# Altium project Prototype_1.PrjPcb (part 1 of 2)
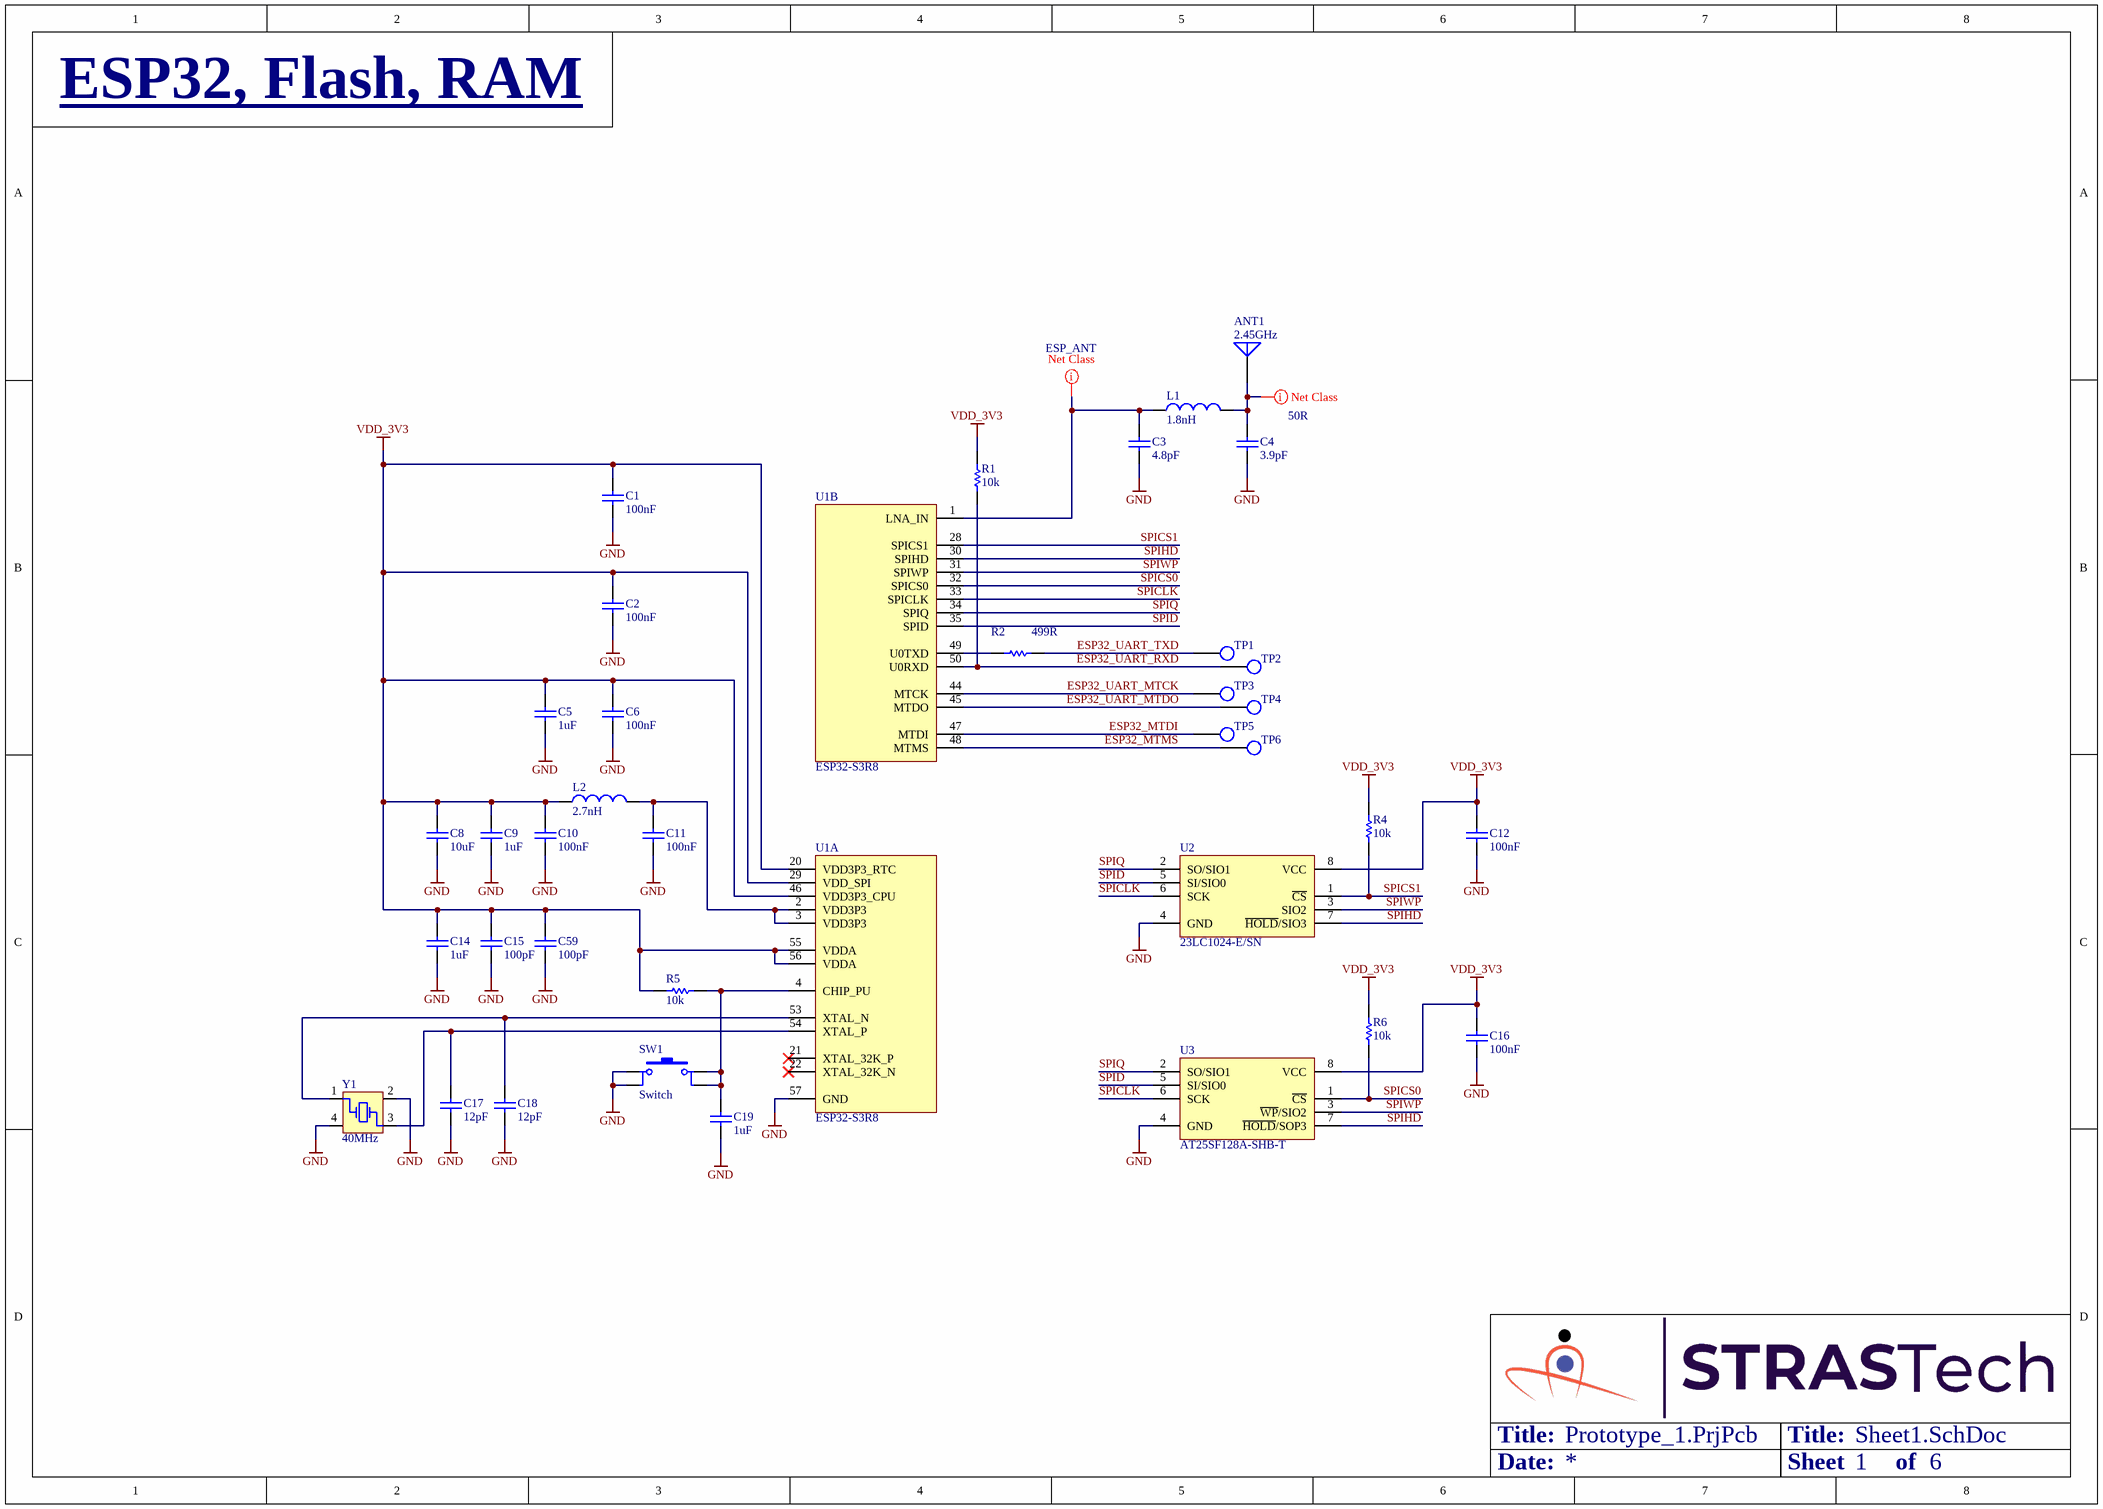
[diagram p0: Sheet1.SchDoc]
6 sheets, 240 parts. Net scope: global (net labels, ports and power ports of the same name join across sheets).
Board file: PCB1.PcbDoc
Sheets:
  Sheet1.SchDoc
  Sheet2.SchDoc
  Sheet3.SchDoc
  Sheet4.SchDoc
  Sheet5.SchDoc
  Sheet6.SchDoc

## Sheet Sheet1.SchDoc
size A3; Organization: Altium Limited; Address1: L3, 12a Rodborough Rd; Address2: Frenchs Forest; Address3: NSW; Address4: Australia 2086; SheetNumber: 1; SheetTotal: 6

### Parts
ANT1  2.45GHz  [ANT,PCB,IFA,2.45GHZ]
C1  100nF  [Cap,SMD,0402]
C2  100nF  [Cap,SMD,0402]
C3  4.8pF  [Cap,SMD,0402]
C4  3.9pF  [Cap,SMD,0402]
C5  1uF  [Cap,SMD,0402]
C6  100nF  [Cap,SMD,0402]
C8  10uF  [Cap,SMD,0402]
C9  1uF  [Cap,SMD,0402]
C10  100nF  [Cap,SMD,0402]
C11  100nF  [Cap,SMD,0402]
C12  100nF  [Cap,SMD,0402]
C14  1uF  [Cap,SMD,0402]
C15  100pF  [Cap,SMD,0402]
C16  100nF  [Cap,SMD,0402]
C17  12pF  [Cap,SMD,0402]
C18  12pF  [Cap,SMD,0402]
C19  1uF  [Cap,SMD,0402]
C59  100pF  [Cap,SMD,0402]
L1  1.8nH  [ind,0402]
L2  2.7nH  [ind,0402]
R1  10k  [RES,0402]
R2  499R  [RES,0402]
R4  10k  [RES,0402]
R5  10k  [RES,0402]
R6  10k  [RES,0402]
SW1  Switch  [Switch,Tactile,Micro,SPST-NO,SMD]
TP1  TESTPOINT  [testpoint,smd,round,1mm]  (value not drawn)
TP2  TESTPOINT  [testpoint,smd,round,1mm]  (value not drawn)
TP3  TESTPOINT  [testpoint,smd,round,1mm]  (value not drawn)
TP4  TESTPOINT  [testpoint,smd,round,1mm]  (value not drawn)
TP5  TESTPOINT  [testpoint,smd,round,1mm]  (value not drawn)
TP6  TESTPOINT  [testpoint,smd,round,1mm]  (value not drawn)
U1  ESP32-S3R8  [IC,QFN-56,7X7,P0.4MM]  (parts A,B of 3)
U2  23LC1024-E/SN  [IC,SOIC-8,1.27mm,W3.9]
U3  AT25SF128A-SHB-T  [IC,SOIC-8,1.27mm,W3.9]
Y1  40MHz  [XTAL,SMD,4 Pin,2x2.5mm]

### Nets
GND: C1.1 C2.1 C3.1 C4.1 C5.1 C6.1 C8.1 C9.1 C10.1 C11.1 C12.1 C14.1 C15.1 C16.1 C17.2 C18.2 C19.1 C59.1 SW1.1 SW1.2 U1.57(GND) U2.4(GND) U3.4(GND) Y1.2(GND) Y1.4(GND)
VDD_3V3: C1.2 C2.2 C5.2 C6.2 C8.2 C9.2 C10.2 C12.2 C14.2 C15.2 C16.2 C59.2 L2.1 R1.2 R4.2 R5.2 R6.2 U1.20(VDD3P3_RTC) U1.29(VDD_SPI) U1.46(VDD3P3_CPU) U1.55(VDDA) U1.56(VDDA) U2.8(VCC) U3.8(VCC)
ESP32_MTDI: TP5.1(TP) U1.47(MTDI)
ESP32_MTMS: TP6.1(TP) U1.48(MTMS)
ESP32_UART_MTCK: TP3.1(TP) U1.44(MTCK)
ESP32_UART_MTDO: TP4.1(TP) U1.45(MTDO)
ESP32_UART_RXD: R1.1 TP2.1(TP) U1.50(U0RXD)
ESP32_UART_TXD: R2.2 TP1.1(TP)
SPICLK: U1.33(SPICLK) U2.6(SCK) U3.6(SCK)
SPICS0: R6.1 U1.32(SPICS0) U3.1(~{CS})
SPICS1: R4.1 U1.28(SPICS1) U2.1(~{CS})
SPID: U1.35(SPID) U2.5(SI/SIO0) U3.5(SI/SIO0)
SPIHD: U1.30(SPIHD) U2.7(~{HOLD}/SIO3) U3.7(~{HOLD}/SOP3)
SPIQ: U1.34(SPIQ) U2.2(SO/SIO1) U3.2(SO/SIO1)
SPIWP: U1.31(SPIWP) U2.3(SIO2) U3.3(~{WP}/SIO2)
NetANT1_1: ANT1.1 C4.2 L1.2
NetC3_2: C3.2 L1.1 U1.1(LNA_IN)
NetC11_2: C11.2 L2.2 U1.2(VDD3P3) U1.3(VDD3P3)
NetC17_1: C17.1 U1.54(XTAL_P) Y1.3(OSC2)
NetC18_1: C18.1 U1.53(XTAL_N) Y1.1(OSC1)
NetC19_2: C19.2 R5.1 SW1.3 SW1.4 U1.4(CHIP_PU)
NetR2_1: R2.1 U1.49(U0TXD)

Not connected (* = marked no-connect by the designer): U1 21(XTAL_32K_P)* 22(XTAL_32K_N)*

### Layout directives
net class ESP_ANT: NetC3_2
net class 50R: NetANT1_1

### Notes on the sheet
- ESP32, Flash, RAM
- Title:
- Date:
- Sheet
- of
- Title
- Size:
- A3
- Revision:
- Design By:

### Library data of the parts
ANT1 = ANT,2.45GHz,IFA,PCB: 2.4-GHz Inverted F Antenna; HelpURL: https://www.ti.com/lit/an/swru120d/swru120d.pdf?ts=1646240772720&ref_url=https%253A%252F%252Fwww.google.com%252F; CreatedBy: Judd Foster; Manufacturer: N/A; Manufacturer Part Number: N/A; Vendor: N/A; Vendor Part Number: N/A
C1 C2 C6 C10-C12 C16 = CAP,Cer,100nF,25VDC,X7R,0402: 0.1µF ±10% 25V Ceramic Capacitor X7R 0402 (1005 Metric); Vendor Part Number: 490-14603-1-ND; Manufacturer: Murata Electronics; Manufacturer Part Number: GRM155R71E104KE14J; Vendor: Digikey; HelpURL: https://search.murata.co.jp/Ceramy/image/img/A01X/G101/ENG/GRM155R71E104KE14-01.pdf; CreatedBy: Judd Foster
C3 = CAP,Cer,4.8pF,50VDC,C0G/NP0,0402: 4.8 pF ±0.25pF 50V Ceramic Capacitor C0G, NP0 0402 (1005 Metric); Vendor Part Number: 490-17481-1-ND; Manufacturer: Murata Electronics; Manufacturer Part Number: GCQ1555C1H4R8CB01D; Vendor: Digikey; HelpURL: https://search.murata.co.jp/Ceramy/image/img/A01X/G101/ENG/GCQ1555C1H4R8CB01-01.pdf; CreatedBy: Judd Foster
C4 = CAP,Cer,3.9pF,50VDC,C0G/NP0,0402: 3.9 pF ±0.1pF 50V Ceramic Capacitor C0G, NP0 0402 (1005 Metric); Vendor Part Number: 399-CBR04C399B5GACCT-ND; Manufacturer: KEMET; Manufacturer Part Number: CBR04C399B5GAC; Vendor: Digikey; HelpURL: https://api.kemet.com/component-edge/download/datasheet/CBR04C399B5GAC.pdf; CreatedBy: Judd Foster
C5 C9 C14 = CAP,Cer,1uF,35VDC,X5R,0402: 1 µF ±10% 35V Ceramic Capacitor X5R 0402 (1005 Metric); Vendor Part Number: 445-9073-1-ND; Manufacturer: TDK Corporation; Manufacturer Part Number: C1005X5R1V105K050BC; Vendor: Digikey; HelpURL: https://product.tdk.com/info/en/catalog/datasheets/mlcc_commercial_general_en.pdf?ref_disty=digikey; CreatedBy: Judd Foster
C8 = CAP,Cer,10uF,10VDC,X5R,0402: 10 µF ±20% 10V Ceramic Capacitor X5R 0402 (1005 Metric); Vendor Part Number: 1276-1450-1-ND; Manufacturer: Samsung Electro-Mechanics; Manufacturer Part Number: CL05A106MP5NUNC; Vendor: Digikey; HelpURL: https://media.digikey.com/pdf/Data%20Sheets/Samsung%20PDFs/CL05A106MP5NUNC_Spec.pdf; CreatedBy: Judd Foster
C15 C59 = CAP,Cer,100pF,50VDC,C0G/NP0,0402: 100pF ±5% 50V Ceramic Capacitor C0G, NP0 0402 (1005 Metric); Vendor Part Number: 490-10669-1-ND; Manufacturer: Murata Electronics; Manufacturer Part Number: GCM1555C1H101JA16D; Vendor: Digikey; HelpURL: https://www.murata.com/~/media/webrenewal/support/library/catalog/products/capacitor/mlcc/c03e.ashx?la=en-us; CreatedBy: Judd Foster
C17 C18 = CAP,Cer,12pF,50VDC,C0G/NP0,0402: 12pF ±5% 50V Ceramic Capacitor C0G, NP0 0402 (1005 Metric); Vendor Part Number: 311-1016-1-ND; Manufacturer: Yageo; Manufacturer Part Number: CC0402JRNPO9BN120; Vendor: Digikey; HelpURL: https://www.yageo.com/upload/media/product/productsearch/datasheet/mlcc/UPY-GP_NP0_16V-to-50V_18.pdf; CreatedBy: Judd Foster
C19 = CAP,Cer,1uF,6.3VDC,X5R,0402: 1µF ±20% 6.3V Ceramic Capacitor X5R 0402 (1005 Metric); Vendor Part Number: 1276-1235-1-ND; Manufacturer: Samsung Electro-Mechanics; Manufacturer Part Number: CL05A105MQ5NNNC; Vendor: Digikey; HelpURL: https://media.digikey.com/pdf/Data%20Sheets/Samsung%20PDFs/CL_Series_MLCC_ds.pdf; CreatedBy: Judd Foster
L1 = IND,1.8nH,900mA,Multilayer,0402: 1.8 nH Unshielded Multilayer Inductor 900 mA 100mOhm Max 0402 (1005 Metric); Vendor Part Number: 490-1076-1-ND; Manufacturer: Murata Electronics; Manufacturer Part Number: LQG15HN1N8S02D; Vendor: Digikey; HelpURL: https://search.murata.co.jp/Ceramy/image/img/P02/JELF243B-0009.pdf; CreatedBy: Judd Foster
L2 = IND,2.7nH,800mA,Multilayer,0402: 2.7nH Unshielded Multilayer Inductor 800mA 150mOhm Max 0402 (1005 Metric); Vendor Part Number: 490-2615-1-ND; Manufacturer: Murata Electronics; Manufacturer Part Number: LQG15HS2N7S02D; Vendor: Digikey; HelpURL: https://psearch.en.murata.com/inductor/product/LQG15HS2N7S02_.pdf; CreatedBy: Judd Foster
R1 R4-R6 = RES,10k,5%,0.063W,0402: 10 kOhms ±5% 0.063W, 1/16W Chip Resistor 0402 (1005 Metric) Automotive AEC-Q200 Thick Film; Vendor Part Number: RMCF0402JT10K0CT-ND; Manufacturer: Stackpole Electronics Inc; Manufacturer Part Number: RMCF0402JT10K0; Vendor: DIgikey; HelpURL: https://www.seielect.com/catalog/sei-rmcf_rmcp.pdf; CreatedBy: Judd Foster
R2 = RES,499R,1%,0.063W,0402: 499 Ohms ±1% 0.063W, 1/16W Chip Resistor 0402 (1005 Metric) Automotive AEC-Q200 Thick Film; Manufacturer: Stackpole Electronics Inc; Manufacturer Part Number: RMCF0402FT499R; Vendor Part Number: RMCF0402FT499RCT-ND; Vendor: Digikey; CreatedBy: Judd Foster; HelpURL: https://www.seielect.com/catalog/sei-rmcf_rmcp.pdf
SW1 = Switch,Tactile,SPST-NO,SMD,H1.5: Tactile Switch SPST-NO Top Actuated Surface Mount; Manufacturer: C&K; Manufacturer Part Number: PTS525SM15SMTR2 LFS; Vendor Part Number: CKN9104CT-ND; Vendor: Digikey; CreatedBy: Judd Foster; HelpURL: https://www.ckswitches.com/media/1467/pts525.pdf
TP1-TP6 = TESTPOINT: PCB Testpoint; CreatedBy: Judd Foster; HelpURL: N/A; Manufacturer: N/A; Manufacturer Part Number: N/A; Vendor: N/A; Vendor Part Number: N/A
U1 = ESP32-S3R8: IC RF TxRx + MCU Bluetooth, WiFi 802.11b/g/n, Bluetooth v5.0 2.412GHz ~ 2.484GHz 56-VFQFN Exposed Pad; Manufacturer: Espressif Systems; Vendor Part Number: 1904-ESP32-S3R8-ND; Vendor: Digikey; CreatedBy: Judd Foster; HelpURL: https://www.espressif.com/sites/default/files/documentation/esp32-s3_datasheet_en.pdf; Manufacturer Part Number: ESP32-S3R8
U2 = 23LC1024-E/SN: SRAM Memory IC 1Mb (128K x 8) SPI - Quad I/O 16 MHz 8-SOIC; Manufacturer: Microchip Technology; Vendor Part Number: 23LC1024-E/SN-ND; Vendor: Digikey; CreatedBy: Judd Foster; HelpURL: https://ww1.microchip.com/downloads/en/DeviceDoc/20005142C.pdf; Manufacturer Part Number: 23LC1024-E/SN
U3 = AT25SF128A-SHB-T: FLASH - NOR Memory IC 128Mb (16M x 8) SPI - Quad I/O 133 MHz 8-SOIC; Manufacturer: Adesto Technologies; Vendor Part Number: 1265-1348-1-ND; Vendor: Digikey; CreatedBy: Judd Foster; HelpURL: https://www.dialog-semiconductor.com/sites/default/files/2021-02/DS-AT25SF128A-168.pdf; Manufacturer Part Number: AT25SF128A-SHB-T
Y1 = XTAL,40MHz,12pF,SMD: 40 MHz ±7ppm Crystal 12pF 25 Ohms 4-SMD, No Lead; Manufacturer: Hosonic Electronic Co., Ltd; Manufacturer Part Number: E2SB40E000104E; Vendor Part Number: 3186-E2SB40E000104ECT-ND; Vendor: Digikey; CreatedBy: Judd Foster; HelpURL: https://ecsxtal.com/store/pdf/ECS-33B.pdf

## Sheet Sheet2.SchDoc
size A3; Organization: Altium Limited; Address1: L3, 12a Rodborough Rd; Address2: Frenchs Forest; Address3: NSW; Address4: Australia 2086; SheetNumber: 2; SheetTotal: 6
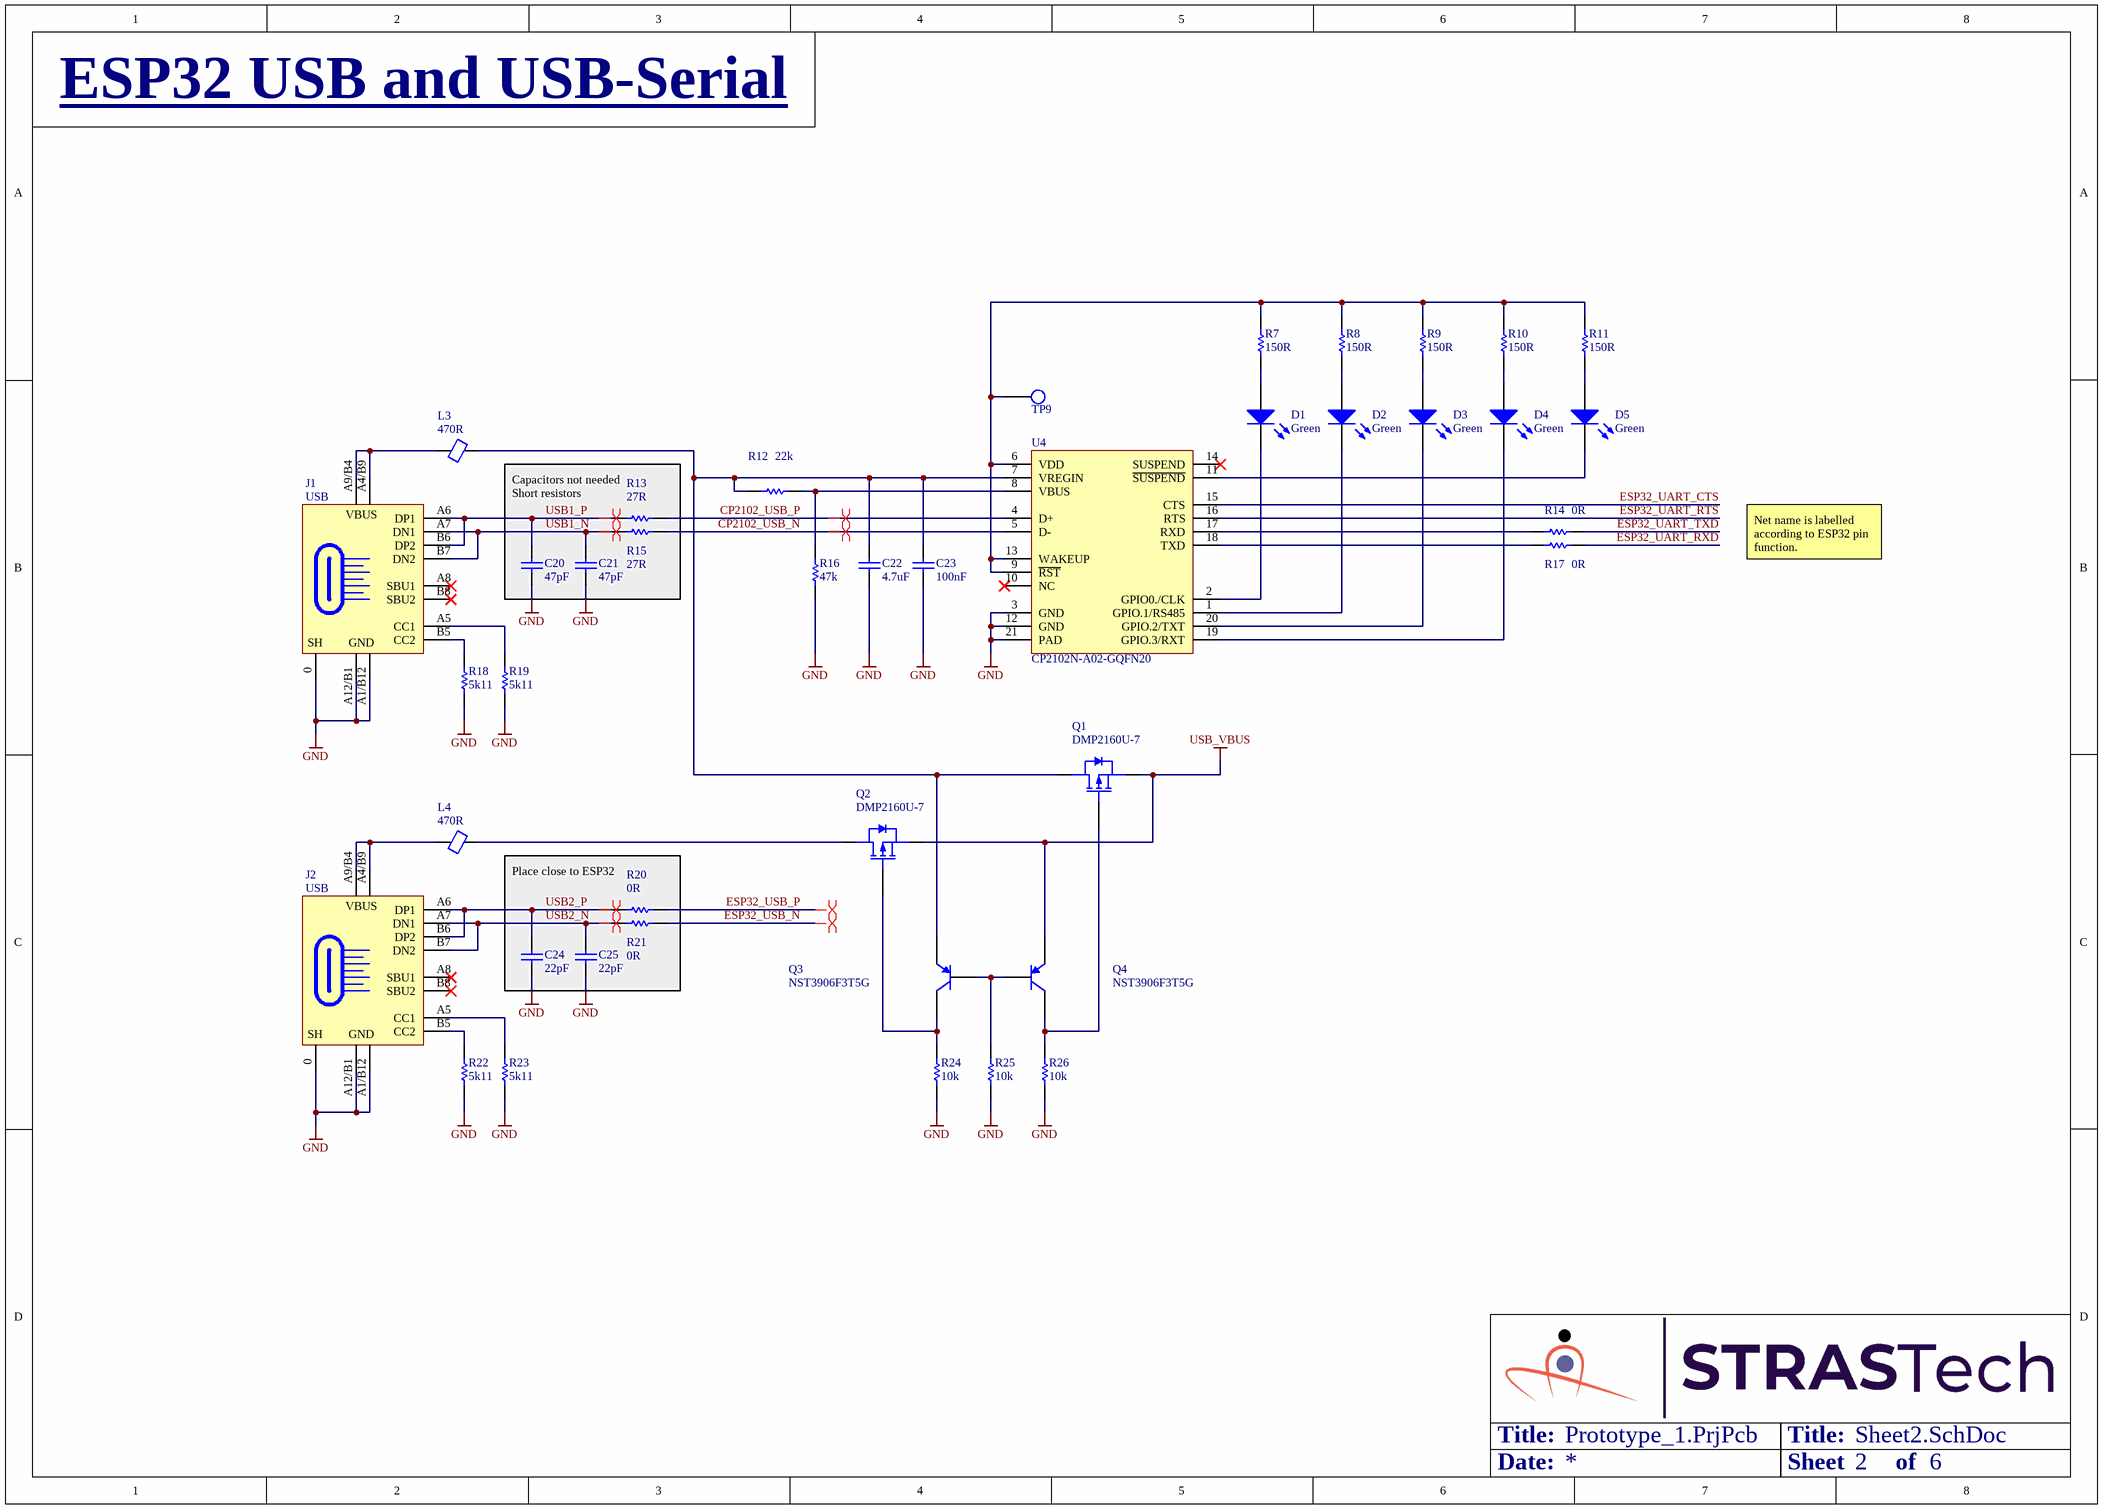
[diagram p1: Sheet2.SchDoc]

### Parts
C20  47pF  [Cap,SMD,0402]
C21  47pF  [Cap,SMD,0402]
C22  4.7uF  [Cap,SMD,0402]
C23  100nF  [Cap,SMD,0402]
C24  22pF  [Cap,SMD,0402]
C25  22pF  [Cap,SMD,0402]
D1  Green  [LED,0603]
D2  Green  [LED,0603]
D3  Green  [LED,0603]
D4  Green  [LED,0603]
D5  Green  [LED,0603]
J1  USB  [CONN,USB_C,SMD]
J2  USB  [CONN,USB_C,SMD]
L3  470R  [IND,0402]
L4  470R  [IND,0402]
Q1  DMP2160U-7  [SOT23-3]
Q2  DMP2160U-7  [SOT23-3]
Q3  NST3906F3T5G  [SOT1123]
Q4  NST3906F3T5G  [SOT1123]
R7  150R  [RES,0402]
R8  150R  [RES,0402]
R9  150R  [RES,0402]
R10  150R  [RES,0402]
R11  150R  [RES,0402]
R12  22k  [RES,0402]
R13  27R  [RES,0402]
R14  0R  [RES,0402]
R15  27R  [RES,0402]
R16  47k  [RES,0402]
R17  0R  [RES,0402]
R18  5k11  [RES,0402]
R19  5k11  [RES,0402]
R20  0R  [RES,0402]
R21  0R  [RES,0402]
R22  5k11  [RES,0402]
R23  5k11  [RES,0402]
R24  10k  [RES,0402]
R25  10k  [RES,0402]
R26  10k  [RES,0402]
TP9  TESTPOINT  [testpoint,smd,round,1mm]  (value not drawn)
U4  CP2102N-A02-GQFN20  [IC,QFN-20,3x3,PAD]

### Nets
GND: C20.1 C21.1 C22.1 C23.1 C24.1 C25.1 J1.0(SHIELD) J1.A1/B12(GND) J1.A12/B1(GND) J2.0(SHIELD) J2.A1/B12(GND) J2.A12/B1(GND) R16.1 R18.1 R19.1 R22.1 R23.1 R24.2 R25.2 R26.2 U4.3(GND) U4.12(GND) U4.21(PAD)
USB_VBUS: Q1.2(S) Q2.2(S) Q4.2(E)
CP2102_USB_N: R15.2 U4.5(D-)
CP2102_USB_P: R13.2 U4.4(D+)
ESP32_UART_CTS: U4.15(CTS)
ESP32_UART_RTS: U4.16(RTS)
ESP32_UART_RXD: R17.2
ESP32_UART_TXD: R14.2
ESP32_USB_N: R21.2
ESP32_USB_P: R20.2
USB1_N: C21.2 J1.A7(DN1) J1.B7(DN2) R15.1
USB1_P: C20.2 J1.A6(DP1) J1.B6(DP2) R13.1
USB2_N: C25.2 J2.A7(DN1) J2.B7(DN2) R21.1
USB2_P: C24.2 J2.A6(DP1) J2.B6(DP2) R20.1
NetC22_2: C22.2 C23.2 L3.2 Q1.3(D) Q3.2(E) R12.1 U4.7(VREGIN)
NetD1_1: D1.1(A) R7.1
NetD1_2: D1.2(K) U4.2(GPIO0./CLK)
NetD2_1: D2.1(A) R8.1
NetD2_2: D2.2(K) U4.1(GPIO.1/RS485)
NetD3_1: D3.1(A) R9.1
NetD3_2: D3.2(K) U4.20(GPIO.2/TXT)
NetD4_1: D4.1(A) R10.1
NetD4_2: D4.2(K) U4.19(GPIO.3/RXT)
NetD5_1: D5.1(A) R11.1
NetD5_2: D5.2(K) U4.11(~{SUSPEND})
NetJ1_A4/B9: J1.A4/B9(VBUS) J1.A9/B4(VBUS) L3.1
NetJ1_A5: J1.A5(CC1) R19.2
NetJ1_B5: J1.B5(CC2) R18.2
NetJ2_A4/B9: J2.A4/B9(VBUS) J2.A9/B4(VBUS) L4.1
NetJ2_A5: J2.A5(CC1) R23.2
NetJ2_B5: J2.B5(CC2) R22.2
NetL4_2: L4.2 Q2.3(D)
NetQ1_1: Q1.1(G) Q4.3(C) R26.1
NetQ2_1: Q2.1(G) Q3.3(C) R24.1
NetQ3_1: Q3.1(B) Q4.1(B) R25.1
NetR7_2: R7.2 R8.2 R9.2 R10.2 R11.2 TP9.1(TP) U4.6(VDD) U4.9(~{RST}) U4.13(WAKEUP)
NetR12_2: R12.2 R16.2 U4.8(VBUS)
NetR14_1: R14.1 U4.17(RXD)
NetR17_1: R17.1 U4.18(TXD)

Not connected (* = marked no-connect by the designer): J1 A8(SBU1)* B8(SBU2)*; J2 A8(SBU1)* B8(SBU2)*; U4 10(NC)* 14(SUSPEND)*

### Layout directives
differential pair: CP2102_USB_N, CP2102_USB_P, ESP32_USB_N, ESP32_USB_P, USB1_N, USB1_P, USB2_N, USB2_P

### Notes on the sheet
- ESP32 USB and USB-Serial
- Net name is labelled according to ESP32 pin function.
- Capacitors not needed
  Short resistors
- Place close to ESP32
- Title:
- Date:
- Sheet
- of
- Title
- Size:
- A3
- Revision:
- Design By:
- (in symbol Conn,USB_C,SMD) SH

### Library data of the parts
C20 C21 = CAP,Cer,47pF,50VDC,C0G/NP0,0402: 47pF ±5% 50V Ceramic Capacitor C0G, NP0 0402 (1005 Metric); Vendor Part Number: 1292-1325-1-ND; Manufacturer: Walsin Technology Corporation; Manufacturer Part Number: 0402N470J500CT; Vendor: Digikey; HelpURL: http://www.passivecomponent.com/wp-content/uploads/2018/10/MLCC.pdf; CreatedBy: Judd Foster
C22 = CAP,Cer,4.7uF,16VDC,X5R,0402: 4.7 µF ±20% 16V Ceramic Capacitor X5R 0402 (1005 Metric); Vendor Part Number: 478-10788-1-ND; Manufacturer: AVX Corporation; Manufacturer Part Number: 0402YD475MAT2A; Vendor: Digikey; HelpURL: https://datasheets.avx.com/cx5r.pdf; CreatedBy: Judd Foster
C23 = CAP,Cer,100nF,25VDC,X7R,0402: as C1 on sheet Sheet1; HelpURL: https://search.murata.co.jp/Ceramy/image/img/A01X/G101/ENG/GRM155R71E104KE14-01.pdf; CreatedBy: Judd Foster
C24 C25 = CAP,Cer,22pF,25VDC,C0G/NP0,0402: 22pF ±5% 25V Ceramic Capacitor C0G, NP0 0402 (1005 Metric); Vendor Part Number: 1292-1282-1-ND; Manufacturer: Walsin Technology Corporation; Manufacturer Part Number: 0402N220J250CT; Vendor: Digikey; HelpURL: http://www.passivecomponent.com/wp-content/uploads/ecd/0402N220J250CT-IN.pdf; CreatedBy: Judd Foster
D1-D5 = LED,Green,SMD,0603: Green 530nm LED Indication - Discrete 3V 0603 (1608 Metric); Manufacturer: Stanley Electric Co; Manufacturer Part Number: THG1111C-0005-TR; Vendor Part Number: 404-1286-1-ND; Vendor: Digikey; CreatedBy: Judd Foster; HelpURL: http://www.stanley-components.com/php/downloaddatafile.php?rp=0,THG1111C-0005_e.pdf
J1 J2 = Conn,USB_C,SMD: USB-C (USB TYPE-C) USB 2.0 Receptacle Connector 24 (16+8 Dummy) Position Surface Mount, Right Angle; Manufacturer: GCT; Manufacturer Part Number: USB4110-GF-A; Vendor Part Number: 2073-USB4110-GF-A-1-ND; Vendor: Digikey; CreatedBy: Judd Foster; HelpURL: https://gct.co/files/drawings/usb4110.pdf
L3 L4 = Ferrite,470R@100MHz,0402: 470 Ohms @ 100 MHz 1 Power Line Ferrite Bead 0402 (1005 Metric) 1A 200mOhm; Vendor Part Number: 490-10662-1-ND; Manufacturer: Murata Electronics; Manufacturer Part Number: BLM15PX471SN1D; Vendor: Digikey; HelpURL: https://www.murata.com/en-us/products/productdata/8796740059166/ENFA0018.pdf; CreatedBy: Judd Foster
Q1 Q2 = MOSFET,P Ch,20V,3.2A: P-Channel 20 V 3.2A (Ta) 1.4W (Ta) Surface Mount SOT-23-3; Manufacturer: Diodes Incorporated; Vendor Part Number: DMP2160UDICT-ND; Vendor: Digikey; CreatedBy: Judd Foster; HelpURL: https://media.digikey.com/pdf/Data%20Sheets/Diodes%20PDFs/DMP2160U.pdf; Manufacturer Part Number: DMP2160U-7
Q3 Q4 = Trans,PNP,40V,200mA,SOT1123: Bipolar (BJT) Transistor PNP 40 V 200 mA 250MHz 290 mW Surface Mount SOT-1123; Manufacturer: ON Semiconductor; Vendor Part Number: NST3906F3T5GOSCT-ND; Vendor: Digikey; CreatedBy: Judd Foster; HelpURL: https://www.onsemi.com/pdf/datasheet/nst3906f3-d.pdf; Manufacturer Part Number: NST3906F3T5G
R7-R11 = RES,150R,1%,0.1W,0402: 150 Ohms ±1% 0.063W, 1/16W Chip Resistor 0402 (1005 Metric) Automotive AEC-Q200, Moisture Resistant Thick Film; Manufacturer: TE Connectivity Passive Product; Manufacturer Part Number: CRGCQ0402F150R; Vendor Part Number: A129617CT-ND; Vendor: Digikey; CreatedBy: Judd Foster; HelpURL: https://www.te.com/commerce/DocumentDelivery/DDEController?Action=srchrtrv&DocNm=1773204-3&DocType=DS&DocLang=English
R12 = RES,22k,1%,0.063W,0402: 22 kOhms ±1% 0.063W, 1/16W Chip Resistor 0402 (1005 Metric) Automotive AEC-Q200 Thick Film; Vendor Part Number: RMCF0402FT22K0CT-ND; Manufacturer: Stackpole Electronics Inc; Manufacturer Part Number: RMCF0402FT22K0; Vendor: DIgikey; HelpURL: https://www.seielect.com/catalog/sei-rmcf_rmcp.pdf; CreatedBy: Judd Foster
R13 R15 = RES,27R,5%,0.063W,0402: 27 Ohms ±5% 0.063W, 1/16W Chip Resistor 0402 (1005 Metric) Automotive AEC-Q200 Thick Film; Vendor Part Number: RMCF0402JT27R0CT-ND; Manufacturer: Stackpole Electronics Inc; Manufacturer Part Number: RMCF0402JT27R0; Vendor: DIgikey; HelpURL: https://www.seielect.com/catalog/sei-rmcf_rmcp.pdf; CreatedBy: Judd Foster
R14 R17 R20 R21 = RES,0R0,0.1W,0402: 0 Ohms Jumper 0.1W, 1/10W Chip Resistor 0402 (1005 Metric) Automotive AEC-Q200 Thick Film; Manufacturer: Panasonic Electronic Components; Manufacturer Part Number: ERJ-2GE0R00X; Vendor Part Number: P0.0JCT-ND; Vendor: Digikey; CreatedBy: Judd Foster; HelpURL: https://industrial.panasonic.com/cdbs/www-data/pdf/RDA0000/AOA0000C301.pdf
R16 = RES,47k,1%,0.1W,0402: 47 kOhms ±1% 0.1W, 1/10W Chip Resistor 0402 (1005 Metric) Automotive AEC-Q200 Thick Film; Manufacturer: Panasonic Electronic Components; Manufacturer Part Number: ERJ-2RKF4702X; Vendor Part Number: P47.0KLCT-ND; Vendor: Digikey; CreatedBy: Judd Foster; HelpURL: https://industrial.panasonic.com/cdbs/www-data/pdf/RDA0000/AOA0000C304.pdf
R18 R19 R22 R23 = RES,5k11,1%,0.063W,0402: 5.11 kOhms ±1% 0.063W, 1/16W Chip Resistor 0402 (1005 Metric) Automotive AEC-Q200, Moisture Resistant Thick Film; Manufacturer: Yageo; Manufacturer Part Number: AC0402FR-075K11L; Vendor Part Number: 13-AC0402FR-075K11LCT-ND; Vendor: Digikey; CreatedBy: Judd Foster; HelpURL: https://www.yageo.com/upload/media/product/productsearch/datasheet/rchip/PYu-AC_51_RoHS_L_7.pdf
R24-R26 = RES,10k,5%,0.063W,0402: as R1 on sheet Sheet1; HelpURL: https://www.seielect.com/catalog/sei-rmcf_rmcp.pdf; CreatedBy: Judd Foster
TP9 = TESTPOINT: PCB Testpoint; CreatedBy: Judd Foster; HelpURL: N/A; Manufacturer: N/A; Manufacturer Part Number: N/A; Vendor: N/A; Vendor Part Number: N/A
U4 = CP2102N-A02-GQFN20: USB Bridge, USB to UART USB 2.0 UART Interface 20-QFN (3x3); Manufacturer: Silicon Labs; Vendor Part Number: 336-5885-ND; Vendor: Digikey; CreatedBy: Judd Foster; HelpURL: https://www.silabs.com/documents/public/data-sheets/cp2102n-datasheet.pdf; Manufacturer Part Number: CP2102N-A02-GQFN20

## Sheet Sheet3.SchDoc
size A3; Organization: Altium Limited; Address1: L3, 12a Rodborough Rd; Address2: Frenchs Forest; Address3: NSW; Address4: Australia 2086; SheetNumber: 3; SheetTotal: 6
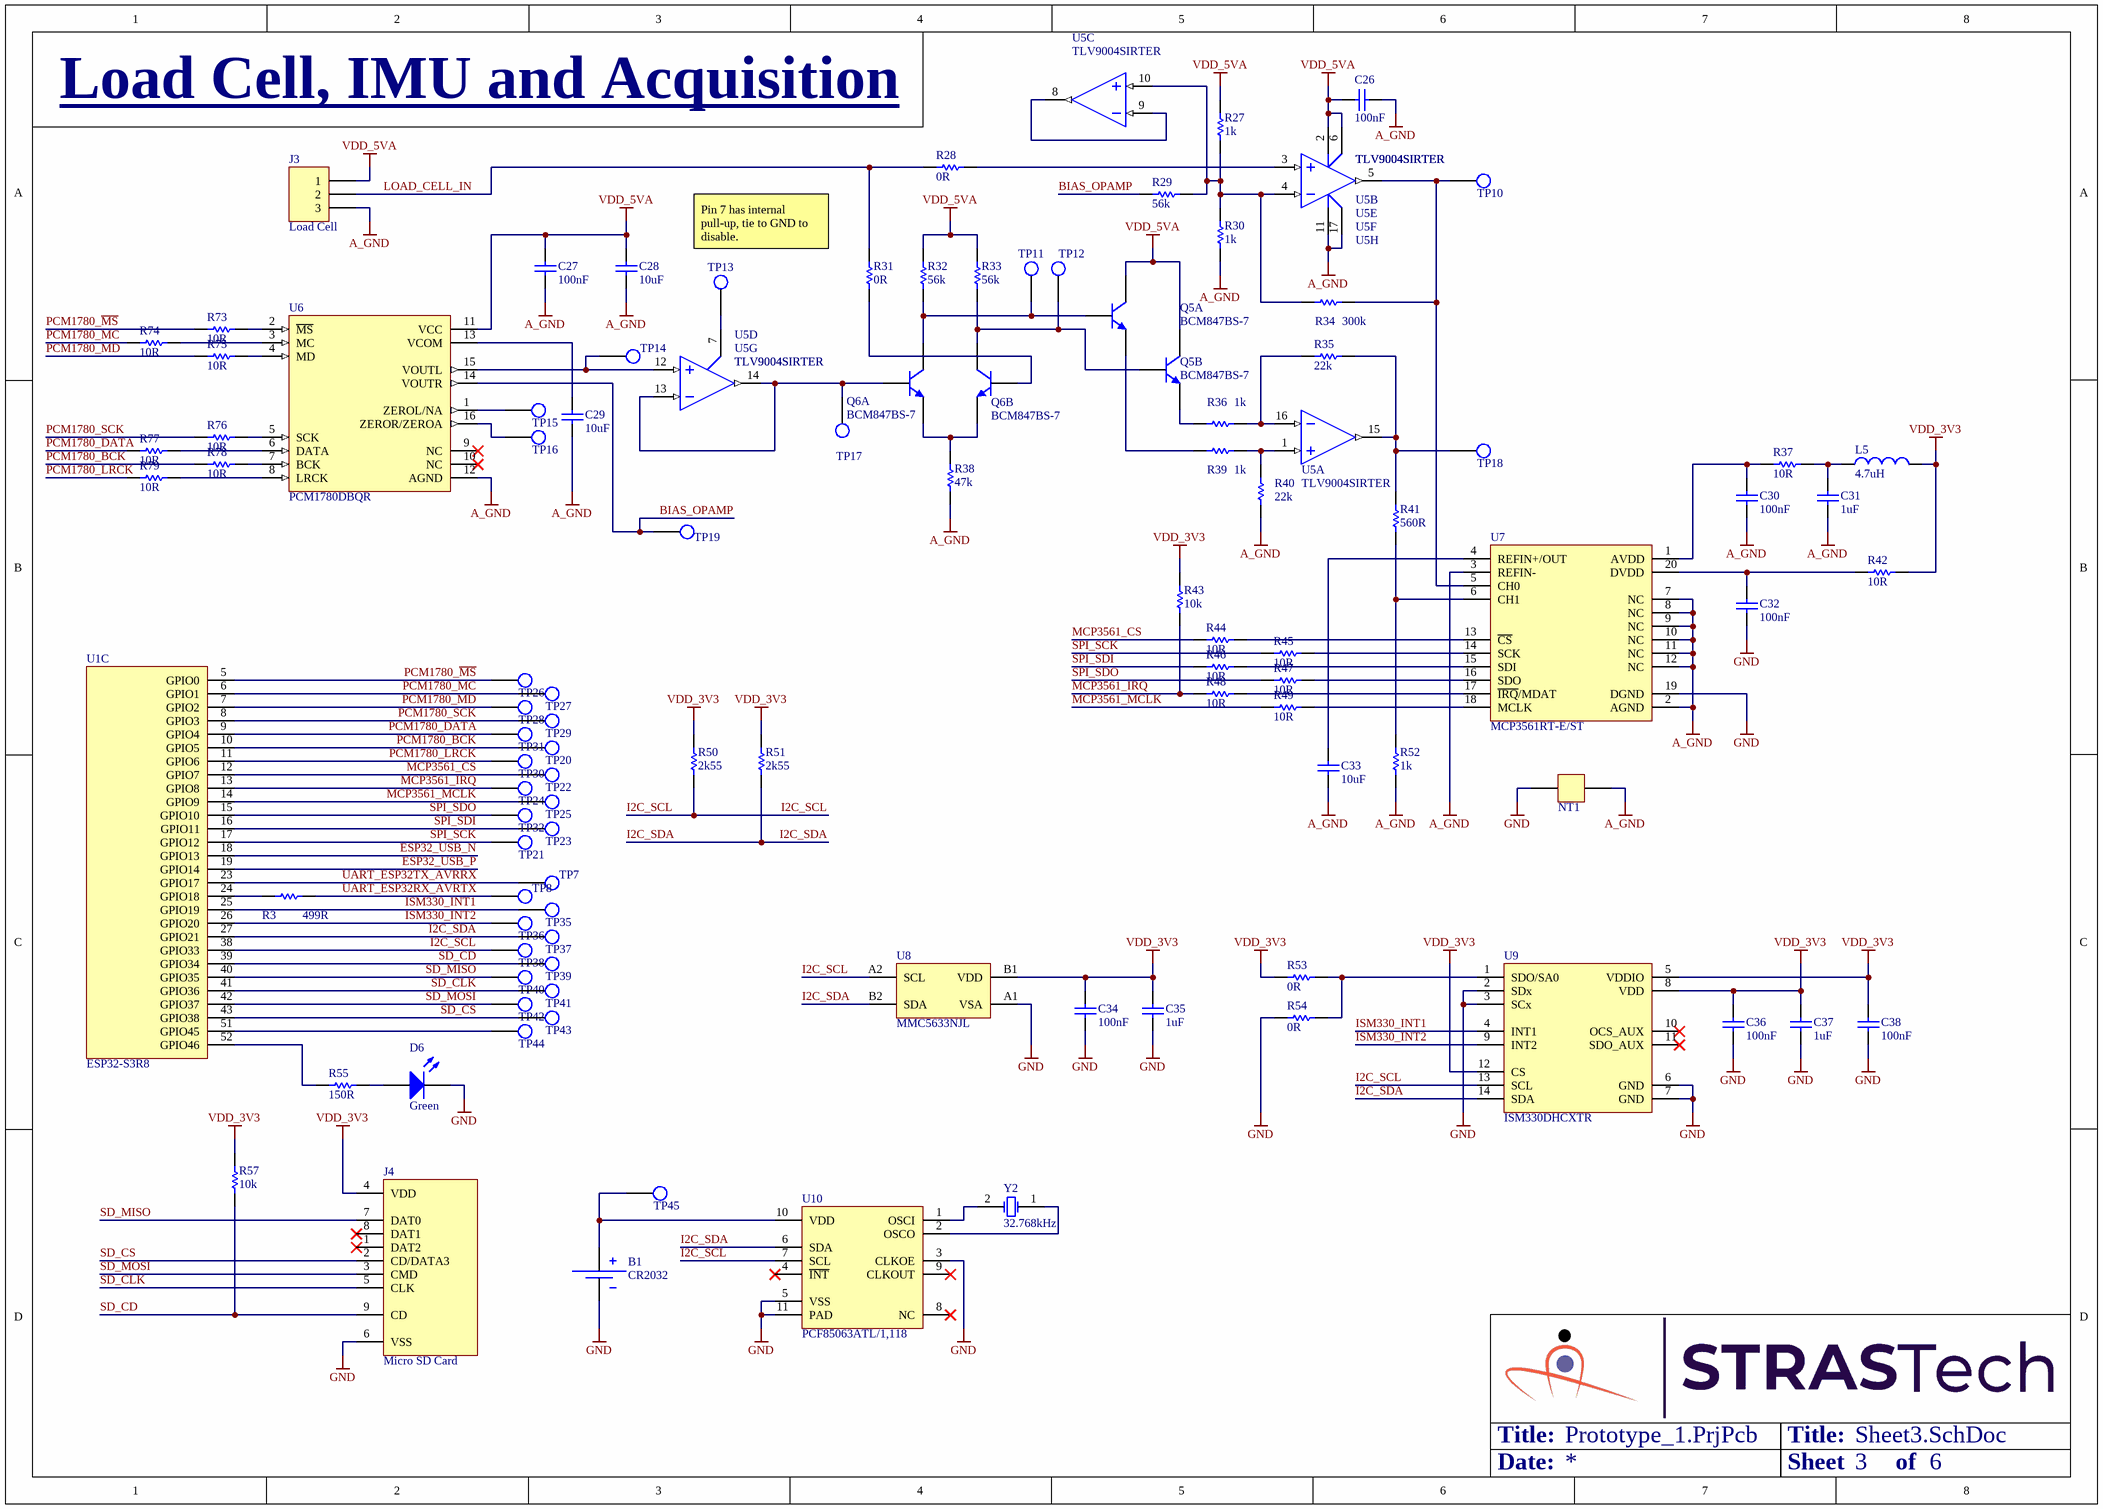
[diagram p2: Sheet3.SchDoc]

### Parts
B1  CR2032  [Holder,Cell,CR2032,PCB,SMD]
C26  100nF  [Cap,SMD,0402]
C27  100nF  [Cap,SMD,0402]
C28  10uF  [Cap,SMD,0402]
C29  10uF  [Cap,SMD,0402]
C30  100nF  [Cap,SMD,0402]
C31  1uF  [Cap,SMD,0402]
C32  100nF  [Cap,SMD,0402]
C33  10uF  [Cap,SMD,0402]
C34  100nF  [Cap,SMD,0402]
C35  1uF  [Cap,SMD,0402]
C36  100nF  [Cap,SMD,0402]
C37  1uF  [Cap,SMD,0402]
C38  100nF  [Cap,SMD,0402]
D6  Green  [LED,0603]
J3  Term,Header,3 Pin,Top,2.54mm  [Term,Header,3Pin,2.54mm]  (value not drawn)
J4  Micro SD Card  [Conn,MicroSD,Push-Push,SMD]
L5  4.7uH  [IND,0805]
NT1  Net Tie  [Net Tie,20x60mil]  (value not drawn)  (net tie, no BOM)
Q5  BCM847BS-7  [SOT363]  (parts A,B of 2)
Q6  BCM847BS-7  [SOT363]  (parts A,B of 2)
R3  499R  [RES,0402]
R27  1k  [RES,0402]
R28  0R  [RES,0402]
R29  56k  [RES,0402]
R30  1k  [RES,0402]
R31  0R  [RES,0402]
R32  56k  [RES,0402]
R33  56k  [RES,0402]
R34  300k  [RES,0402]
R35  22k  [RES,0402]
R36  1k  [RES,0402]
R37  10R  [RES,0402]
R38  47k  [RES,0402]
R39  1k  [RES,0402]
R40  22k  [RES,0402]
R41  560R  [RES,0402]
R42  10R  [RES,0402]
R43  10k  [RES,0402]
R44  10R  [RES,0402]
R45  10R  [RES,0402]
R46  10R  [RES,0402]
R47  10R  [RES,0402]
R48  10R  [RES,0402]
R49  10R  [RES,0402]
R50  2k55  [RES,0402]
R51  2k55  [RES,0402]
R52  1k  [RES,0402]
R53  0R  [RES,0402]
R54  0R  [RES,0402]
R55  150R  [RES,0402]
R57  10k  [RES,0402]
R73  10R  [RES,0402]
R74  10R  [RES,0402]
R75  10R  [RES,0402]
R76  10R  [RES,0402]
R77  10R  [RES,0402]
R78  10R  [RES,0402]
R79  10R  [RES,0402]
TP7  TESTPOINT  [testpoint,smd,round,1mm]  (value not drawn)
TP8  TESTPOINT  [testpoint,smd,round,1mm]  (value not drawn)
TP10  TESTPOINT  [testpoint,smd,round,1mm]  (value not drawn)
TP11  TESTPOINT  [testpoint,smd,round,1mm]  (value not drawn)
TP12  TESTPOINT  [testpoint,smd,round,1mm]  (value not drawn)
TP13  TESTPOINT  [testpoint,smd,round,1mm]  (value not drawn)
TP14  TESTPOINT  [testpoint,smd,round,1mm]  (value not drawn)
TP15  TESTPOINT  [testpoint,smd,round,1mm]  (value not drawn)
TP16  TESTPOINT  [testpoint,smd,round,1mm]  (value not drawn)
TP17  TESTPOINT  [testpoint,smd,round,1mm]  (value not drawn)
TP18  TESTPOINT  [testpoint,smd,round,1mm]  (value not drawn)
TP19  TESTPOINT  [testpoint,smd,round,1mm]  (value not drawn)
TP20  TESTPOINT  [testpoint,smd,round,1mm]  (value not drawn)
TP21  TESTPOINT  [testpoint,smd,round,1mm]  (value not drawn)
TP22  TESTPOINT  [testpoint,smd,round,1mm]  (value not drawn)
TP23  TESTPOINT  [testpoint,smd,round,1mm]  (value not drawn)
TP24  TESTPOINT  [testpoint,smd,round,1mm]  (value not drawn)
TP25  TESTPOINT  [testpoint,smd,round,1mm]  (value not drawn)
TP26  TESTPOINT  [testpoint,smd,round,1mm]  (value not drawn)
TP27  TESTPOINT  [testpoint,smd,round,1mm]  (value not drawn)
TP28  TESTPOINT  [testpoint,smd,round,1mm]  (value not drawn)
TP29  TESTPOINT  [testpoint,smd,round,1mm]  (value not drawn)
TP30  TESTPOINT  [testpoint,smd,round,1mm]  (value not drawn)
TP31  TESTPOINT  [testpoint,smd,round,1mm]  (value not drawn)
TP32  TESTPOINT  [testpoint,smd,round,1mm]  (value not drawn)
TP35  TESTPOINT  [testpoint,smd,round,1mm]  (value not drawn)
TP36  TESTPOINT  [testpoint,smd,round,1mm]  (value not drawn)
TP37  TESTPOINT  [testpoint,smd,round,1mm]  (value not drawn)
TP38  TESTPOINT  [testpoint,smd,round,1mm]  (value not drawn)
TP39  TESTPOINT  [testpoint,smd,round,1mm]  (value not drawn)
TP40  TESTPOINT  [testpoint,smd,round,1mm]  (value not drawn)
TP41  TESTPOINT  [testpoint,smd,round,1mm]  (value not drawn)
TP42  TESTPOINT  [testpoint,smd,round,1mm]  (value not drawn)
TP43  TESTPOINT  [testpoint,smd,round,1mm]  (value not drawn)
TP44  TESTPOINT  [testpoint,smd,round,1mm]  (value not drawn)
TP45  TESTPOINT  [testpoint,smd,round,1mm]  (value not drawn)
U1  ESP32-S3R8  [IC,QFN-56,7X7,P0.4MM]  (part C of 3)
U5  TLV9004SIRTER  [IC,QFN-16,3x3]  (parts A,B,C,D,E,F,G,H of 8)
U6  PCM1780DBQR  [IC,TSSOP-16,W3.9,P0.635MM]
U7  MCP3561RT-E/ST  [IC,TSSOP-20,W4.4]
U8  MMC5633NJL  [IC,WLP,2x2,P0.4mm]
U9  ISM330DHCXTR  [IC,LGA-14L,2.5x3mm]
U10  PCF85063ATL/1,118  [IC,DFN-10_3x3,P0.5mm]
Y2  32.768kHz  [XTAL,SMD,2PIN,2.0x1.2MM]

### Nets
A_GND: C26.1 C27.1 C28.1 C29.2 C30.1 C31.1 C33.1 J3.3 NT1.2 R30.1 R38.1 R40.1 R52.1 U5.11(V-) U5.17(PAD) U6.12(AGND) U7.2(AGND) U7.3(REFIN-) U7.7(NC) U7.8(NC) U7.9(NC) U7.10(NC) U7.11(NC) U7.12(NC)
GND: B1.2(BATT_N) C32.1 C34.2 C35.1 C36.1 C37.1 C38.1 D6.2(K) J4.6(VSS) NT1.1 R54.1 U7.19(DGND) U8.A1(VSA) U9.2(SDx) U9.3(SCx) U9.6(GND) U9.7(GND) U10.3(CLKOE) U10.5(VSS) U10.11(PAD)
VDD_3V3: C34.1 C35.2 C36.2 C37.2 C38.2 J4.4(VDD) L5.2 R42.2 R43.2 R50.2 R51.2 R53.1 R57.2 U8.B1(VDD) U9.5(VDDIO) U9.8(VDD) U9.12(CS)
VDD_5VA: C26.2 C27.2 C28.2 J3.1 Q5.3(C2) Q5.6(C1) R27.1 R32.2 R33.2 U5.2(V+) U5.6(~{SHDN}12) U6.11(VCC)
BIAS_OPAMP: R29.2 TP19.1(TP) U6.14(VOUTR)
ESP32_USB_N: U1.18(GPIO13)
ESP32_USB_P: U1.19(GPIO14)
I2C_SCL: R50.1 TP38.1(TP) U1.38(GPIO33) U8.A2(SCL) U9.13(SCL) U10.7(SCL)
I2C_SDA: R51.1 TP37.1(TP) U1.27(GPIO21) U8.B2(SDA) U9.14(SDA) U10.6(SDA)
ISM330_INT1: TP35.1(TP) U1.25(GPIO19) U9.4(INT1)
ISM330_INT2: TP36.1(TP) U1.26(GPIO20) U9.9(INT2)
LOAD_CELL_IN: J3.2 R28.1 R31.1
MCP3561_CS: R44.1 TP22.1(TP) U1.12(GPIO7)
MCP3561_IRQ: R43.1 R48.1 TP24.1(TP) U1.13(GPIO8)
MCP3561_MCLK: R49.1 TP25.1(TP) U1.14(GPIO9)
PCM1780_BCK: R78.1 TP20.1(TP) U1.10(GPIO5)
PCM1780_DATA: R77.1 TP31.1(TP) U1.9(GPIO4)
PCM1780_LRCK: R79.1 TP30.1(TP) U1.11(GPIO6)
PCM1780_~{MS}: R73.1 TP26.1(TP) U1.5(GPIO0)
PCM1780_MC: R74.1 TP27.1(TP) U1.6(GPIO1)
PCM1780_MD: R75.1 TP28.1(TP) U1.7(GPIO2)
PCM1780_SCK: R76.1 TP29.1(TP) U1.8(GPIO3)
SD_CD: J4.9(CD) R57.1 TP39.1(TP) U1.39(GPIO34)
SD_CLK: J4.5(CLK) TP41.1(TP) U1.41(GPIO36)
SD_CS: J4.2(CD/DATA3) TP43.1(TP) U1.43(GPIO38)
SD_MISO: J4.7(DAT0) TP40.1(TP) U1.40(GPIO35)
SD_MOSI: J4.3(CMD) TP42.1(TP) U1.42(GPIO37)
SPI_SCK: R45.1 TP21.1(TP) U1.17(GPIO12)
SPI_SDI: R46.1 TP23.1(TP) U1.16(GPIO11)
SPI_SDO: R47.1 TP32.1(TP) U1.15(GPIO10)
UART_ESP32RX_AVRTX: R3.2 TP8.1(TP)
UART_ESP32TX_AVRRX: TP7.1(TP) U1.23(GPIO17)
NetB1_1: B1.1(BATT_P) TP45.1(TP) U10.10(VDD)
NetC29_1: C29.1 U6.13(VCOM)
NetC30_2: C30.2 R37.1 U7.1(AVDD)
NetC31_2: C31.2 L5.1 R37.2
NetC32_2: C32.2 R42.1 U7.20(DVDD)
NetC33_2: C33.2 U7.4(REFIN+/OUT)
NetD6_1: D6.1(A) R55.1
NetQ5_1: Q5.1(E1) R39.1
NetQ5_2: Q5.2(B1) Q6.6(C1) R32.1 TP11.1(TP)
NetQ5_4: Q5.4(E2) R36.1
NetQ5_5: Q5.5(B2) Q6.3(C2) R33.1 TP12.1(TP)
NetQ6_1: Q6.1(E1) Q6.4(E2) R38.2
NetQ6_2: Q6.2(B1) TP17.1(TP) U5.13(IN4-) U5.14(OUT4)
NetQ6_5: Q6.5(B2) R31.2
NetR3_1: R3.1 U1.24(GPIO18)
NetR27_2: R27.2 R29.1 R30.2 R34.2 U5.4(IN2-) U5.10(IN3+)
NetR28_2: R28.2 U5.3(IN2+)
NetR34_1: R34.1 TP10.1(TP) U5.5(OUT2) U7.5(CH0)
NetR35_1: R35.1 R41.2 TP18.1(TP) U5.15(OUT1)
NetR35_2: R35.2 R36.2 U5.16(IN1-)
NetR39_2: R39.2 R40.2 U5.1(IN1+)
NetR41_1: R41.1 R52.2 U7.6(CH1)
NetR44_2: R44.2 U7.13(~{CS})
NetR45_2: R45.2 U7.14(SCK)
NetR46_2: R46.2 U7.15(SDI)
NetR47_2: R47.2 U7.16(SDO)
NetR48_2: R48.2 U7.17(~{IRQ}/MDAT)
NetR49_2: R49.2 U7.18(MCLK)
NetR53_2: R53.2 R54.2 U9.1(SDO/SA0)
NetR55_2: R55.2 U1.52(GPIO46)
NetR73_2: R73.2 U6.2(~{MS})
NetR74_2: R74.2 U6.3(MC)
NetR75_2: R75.2 U6.4(MD)
NetR76_2: R76.2 U6.5(SCK)
NetR77_2: R77.2 U6.6(DATA)
NetR78_2: R78.2 U6.7(BCK)
NetR79_2: R79.2 U6.8(LRCK)
NetTP13_1: TP13.1(TP) U5.7(~{SHDN}34)
NetTP14_1: TP14.1(TP) U5.12(IN4+) U6.15(VOUTL)
NetTP15_1: TP15.1(TP) U6.1(ZEROL/NA)
NetTP16_1: TP16.1(TP) U6.16(ZEROR/ZEROA)
NetTP44_1: TP44.1(TP) U1.51(GPIO45)
NetU5_8: U5.8(OUT3) U5.9(IN3-)
NetU10_1: U10.1(OSCI) Y2.2(GND)
NetU10_2: U10.2(OSCO) Y2.1(OSC1)

Not connected (* = marked no-connect by the designer): J4 1(DAT2)* 8(DAT1)*; U6 9(NC)* 10(NC)*; U9 10(OCS_AUX)* 11(SDO_AUX)*; U10 4(~{INT})* 8(NC)* 9(CLKOUT)*

### Notes on the sheet
- Load Cell, IMU and Acquisition
- (near J3) Load Cell
- Pin 7 has internal pull-up, tie to GND to disable.
- Title:
- Date:
- Sheet
- of
- Title
- Size:
- A3
- Revision:
- Design By:

### Library data of the parts
B1 = Holder,Cell,CR2032,PCB,SMD: Battery Retainer Coin, 20.0mm 1 Cell SMD (SMT) Tab; Manufacturer: Keystone Electronics; Manufacturer Part Number: 3034; Vendor Part Number: 36-3034-ND; Vendor: Digikey; CreatedBy: Judd Foster; HelpURL: https://www.keyelco.com/userAssets/file/M65p9.pdf
C26 C27 C30 C32 C34 C36 C38 = CAP,Cer,100nF,25VDC,X7R,0402: as C1 on sheet Sheet1; HelpURL: https://search.murata.co.jp/Ceramy/image/img/A01X/G101/ENG/GRM155R71E104KE14-01.pdf; CreatedBy: Judd Foster
C28 C29 C33 = CAP,Cer,10uF,10VDC,X5R,0402: as C8 on sheet Sheet1; HelpURL: https://media.digikey.com/pdf/Data%20Sheets/Samsung%20PDFs/CL05A106MP5NUNC_Spec.pdf; CreatedBy: Judd Foster
C31 C35 C37 = CAP,Cer,1uF,35VDC,X5R,0402: as C5 on sheet Sheet1; HelpURL: https://product.tdk.com/info/en/catalog/datasheets/mlcc_commercial_general_en.pdf?ref_disty=digikey; CreatedBy: Judd Foster
D6 = LED,Green,SMD,0603: as D1 on sheet Sheet2; CreatedBy: Judd Foster; HelpURL: http://www.stanley-components.com/php/downloaddatafile.php?rp=0,THG1111C-0005_e.pdf
J3 = Term,Header,3 Pin,Top,2.54mm: CONN HEADER VERT 3POS 2.54MM; Vendor Part Number: 732-5316-ND; Manufacturer: Würth Elektronik; Manufacturer Part Number: 61300311121; Vendor: Digikey; HelpURL: https://katalog.we-online.de/em/datasheet/6130xx11121.pdf; Created By: Judd Foster
J4 = Conn,MicroSD,SMD,Push-Push: 9 (8 + 1) Position Card Connector Secure Digital - microSD™ Surface Mount, Right Angle Gold; Manufacturer: GCT; Manufacturer Part Number: MEM2075-00-140-01-A; Vendor Part Number: 2073-MEM2075-00-140-01-ACT-ND; Vendor: Digikey; CreatedBy: Judd Foster; HelpURL: https://gct.co/files/specs/MEM2075-SPEC.pdf
L5 = IND,4.7uH,80mA,Multilayer,0805: 4.7 µH Shielded Multilayer Inductor 80 mA 300mOhm 0805 (2012 Metric); Vendor Part Number: 445-3169-1-ND; Manufacturer: TDK Corporation; Manufacturer Part Number: MLZ2012E4R7MT000; Vendor: Digikey; HelpURL: https://product.tdk.com/en/system/files?file=dam/doc/product/inductor/inductor/smd/catalog/inductor_commercial_decoupling_mlz2012_en.pdf; CreatedBy: Judd Foster
Q5 Q6 = Trans,Array,NPN/NPN,Matched,45V,100mA,SOT-363: Bipolar (BJT) Transistor Array 2 NPN (Dual) Matched Pair 45V 100mA 100MHz 200mW Surface Mount SOT-363; Manufacturer: Diodes Incorporated; Vendor Part Number: 31-BCM847BS-7CT-ND; Vendor: Digikey; CreatedBy: Judd Foster; HelpURL: https://www.diodes.com/assets/Datasheets/BCM847BS.pdf; Manufacturer Part Number: BCM847BS-7
R3 = RES,499R,1%,0.063W,0402: as R2 on sheet Sheet1; CreatedBy: Judd Foster; HelpURL: https://www.seielect.com/catalog/sei-rmcf_rmcp.pdf
R27 R30 R36 R39 R52 = RES,1k,5%,0.063W,0402: 1 kOhms ±5% 0.063W, 1/16W Chip Resistor 0402 (1005 Metric) Automotive AEC-Q200 Thick Film; Vendor Part Number: RMCF0402JT1K00CT-ND; Manufacturer: Stackpole Electronics Inc; Manufacturer Part Number: RMCF0402JT1K00; Vendor: DIgikey; HelpURL: https://www.seielect.com/catalog/sei-rmcf_rmcp.pdf; CreatedBy: Judd Foster
R28 R31 R53 R54 = RES,0R0,0.1W,0402: as R14 on sheet Sheet2; CreatedBy: Judd Foster; HelpURL: https://industrial.panasonic.com/cdbs/www-data/pdf/RDA0000/AOA0000C301.pdf
R29 R32 R33 = RES,56k,1%,0.063W,0402: 56 kOhms ±1% 0.1W, 1/10W Chip Resistor 0402 (1005 Metric) Automotive AEC-Q200 Thick Film; Manufacturer: Panasonic Electronic Components; Manufacturer Part Number: ERJ-2RKF5602X; Vendor Part Number: P56.0KLCT-ND; Vendor: Digikey; CreatedBy: Judd Foster; HelpURL: https://industrial.panasonic.com/cdbs/www-data/pdf/RDA0000/AOA0000C304.pdf
R34 = RES,300k,1%,0.063W,0402: 300 kOhms ±1% 0.063W, 1/16W Chip Resistor 0402 (1005 Metric) Automotive AEC-Q200 Thick Film; Manufacturer: Stackpole Electronics Inc; Manufacturer Part Number: RMCF0402FT300K; Vendor Part Number: RMCF0402FT300KCT-ND; Vendor: Digikey; CreatedBy: Judd Foster; HelpURL: https://www.seielect.com/catalog/sei-rmcf_rmcp.pdf
R35 R40 = RES,22k,1%,0.063W,0402: as R12 on sheet Sheet2; HelpURL: https://www.seielect.com/catalog/sei-rmcf_rmcp.pdf; CreatedBy: Judd Foster
R37 R42 R44-R49 R73-R79 = RES,10R,1%,0.063W,0402: 10 Ohms ±1% 0.063W, 1/16W Chip Resistor 0402 (1005 Metric) Automotive AEC-Q200 Thick Film; Manufacturer: Panasonic Electronic Components; Manufacturer Part Number: ERJ-2RKF10R0X; Vendor Part Number: P10.0LCT-ND; Vendor: Digikey; CreatedBy: Judd Foster; HelpURL: https://industrial.panasonic.com/cdbs/www-data/pdf/RDA0000/AOA0000C304.pdf
R38 = RES,47k,1%,0.1W,0402: as R16 on sheet Sheet2; CreatedBy: Judd Foster; HelpURL: https://industrial.panasonic.com/cdbs/www-data/pdf/RDA0000/AOA0000C304.pdf
R41 = RES,560R,1%,0.063W,0402: 560 Ohms ±1% 0.063W, 1/16W Chip Resistor 0402 (1005 Metric) Automotive AEC-Q200, Moisture Resistant Thick Film; Manufacturer: TE Connectivity Passive Product; Manufacturer Part Number: CRGCQ0402F560R; Vendor Part Number: A129624CT-ND; Vendor: Digikey; CreatedBy: Judd Foster; HelpURL: https://www.te.com/commerce/DocumentDelivery/DDEController?Action=srchrtrv&DocNm=1773204-3&DocType=DS&DocLang=English
R43 R57 = RES,10k,5%,0.063W,0402: as R1 on sheet Sheet1; HelpURL: https://www.seielect.com/catalog/sei-rmcf_rmcp.pdf; CreatedBy: Judd Foster
R50 R51 = RES,2k55,1%,0.063W,0402: 2.55 kOhms ±1% 0.063W, 1/16W Chip Resistor 0402 (1005 Metric) Automotive AEC-Q200 Thick Film; Manufacturer: Stackpole Electronics Inc; Manufacturer Part Number: RMCF0402FT2K55; Vendor Part Number: RMCF0402FT2K55CT-ND; Vendor: Digikey; CreatedBy: Judd Foster; HelpURL: https://www.seielect.com/catalog/sei-rmcf_rmcp.pdf
R55 = RES,150R,1%,0.1W,0402: as R7 on sheet Sheet2; CreatedBy: Judd Foster; HelpURL: https://www.te.com/commerce/DocumentDelivery/DDEController?Action=srchrtrv&DocNm=1773204-3&DocType=DS&DocLang=English
TP7 TP8 TP10-TP32 TP35-TP45 = TESTPOINT: PCB Testpoint; CreatedBy: Judd Foster; HelpURL: N/A; Manufacturer: N/A; Manufacturer Part Number: N/A; Vendor: N/A; Vendor Part Number: N/A
U1 = ESP32-S3R8: as U1 on sheet Sheet1; CreatedBy: Judd Foster; HelpURL: https://www.espressif.com/sites/default/files/documentation/esp32-s3_datasheet_en.pdf; Manufacturer Part Number: ESP32-S3R8
U5 = TLV9004SIRTER: General Purpose Amplifier 4 Circuit Rail-to-Rail 16-WQFN (3x3); Manufacturer: Texas Instruments; Vendor Part Number: 296-51829-1-ND; Vendor: Digikey; CreatedBy: Judd Foster; HelpURL: https://www.ti.com/general/docs/suppproductinfo.tsp?distId=10&gotoUrl=https%3A%2F%2Fwww.ti.com%2Flit%2Fgpn%2Ftlv9004; Manufacturer Part Number: TLV9004SIRTER
U6 = PCM1780DBQR: DAC, Audio 24 b 200k I²S 16-SSOP; Manufacturer: Texas Instruments; Vendor Part Number: 296-41373-1-ND; Vendor: Digikey; Manufacturer Part Number: PCM1780DBQR; HelpURL: https://www.ti.com/general/docs/suppproductinfo.tsp?distId=10&gotoUrl=https%3A%2F%2Fwww.ti.com%2Flit%2Fgpn%2Fpcm1780; CreatedBy: Judd Foster
U7 = MCP3561RT-E/ST: 24 Bit Analog to Digital Converter 1 Input 1 Sigma-Delta 20-TSSOP; Vendor Part Number: 150-MCP3561RT-E/STCT-ND; Manufacturer: Microchip Technology; Vendor: Digikey; Manufacturer Part Number: MCP3561RT-E/ST; HelpURL: https://ww1.microchip.com/downloads/en/DeviceDoc/MCP3561.2.4R-Data-Sheet-DS200006391A.pdf; CreatedBy: Judd Foster
U8 = MMC5633NJL: Magnetoresistive Sensor X, Y, Z Axis 4-WLP (0.85x0.85); Manufacturer: Memsic Inc.; Vendor Part Number: 1267-MMC5633NJLCT-ND; Vendor: Digikey; CreatedBy: Judd Foster; HelpURL: https://media.digikey.com/pdf/Data%20Sheets/MEMSIC%20PDFs/MMC5633NJL_RevA_3-12-20.pdf; Manufacturer Part Number: MMC5633NJL
U9 = ISM330DHCXTR: Accelerometer, Gyroscope, Temperature, 6 Axis Sensor I²C, SPI Output; Manufacturer: STMicroelectronics; Vendor Part Number: 497-19784-1-ND; Vendor: Digikey; CreatedBy: Judd Foster; HelpURL: https://www.st.com/resource/en/datasheet/ism330dhcx.pdf; Manufacturer Part Number: ISM330DHCXTR
U10 = PCF85063ATL/1,118: Real Time Clock (RTC) IC Clock/Calendar - I²C, 2-Wire Serial 10-XFDFN Exposed Pad; Manufacturer: NXP USA Inc.; Vendor Part Number: 568-10235-1-ND; Vendor: Digikey; CreatedBy: Judd Foster; HelpURL: https://www.nxp.com/docs/en/data-sheet/PCF85063A.pdf; Manufacturer Part Number: PCF85063ATL/1,118
Y2 = XTAL,32.768kHz,9pF,SMD: 32.768 kHz ±20ppm Crystal 9pF 70 kOhms 2-SMD, No Lead; Manufacturer: Micro Crystal AG; Manufacturer Part Number: CM8V-T1A-32.768KHZ-9PF-20PPM-TA-QC; Vendor Part Number: 2195-CM8V-T1A-32.768KHZ-9PF-20PPM-TA-QCCT-ND; Vendor: Digikey; CreatedBy: Judd Foster; HelpURL: https://www.microcrystal.com/fileadmin/Media/Products/32kHz/Datasheet/CM8V-T1A.pdf
NT1 = Net Tie: CreatedBy: Makan Mousavi; HelpURL: N/A; Manufacturer: N/A; Manufacturer Part Number: N/A; Vendor: N/A; Vendor Part Number: N/A

## Sheet Sheet4.SchDoc
size A3; Organization: Altium Limited; Address1: L3, 12a Rodborough Rd; Address2: Frenchs Forest; Address3: NSW; Address4: Australia 2086; SheetNumber: 4; SheetTotal: 6
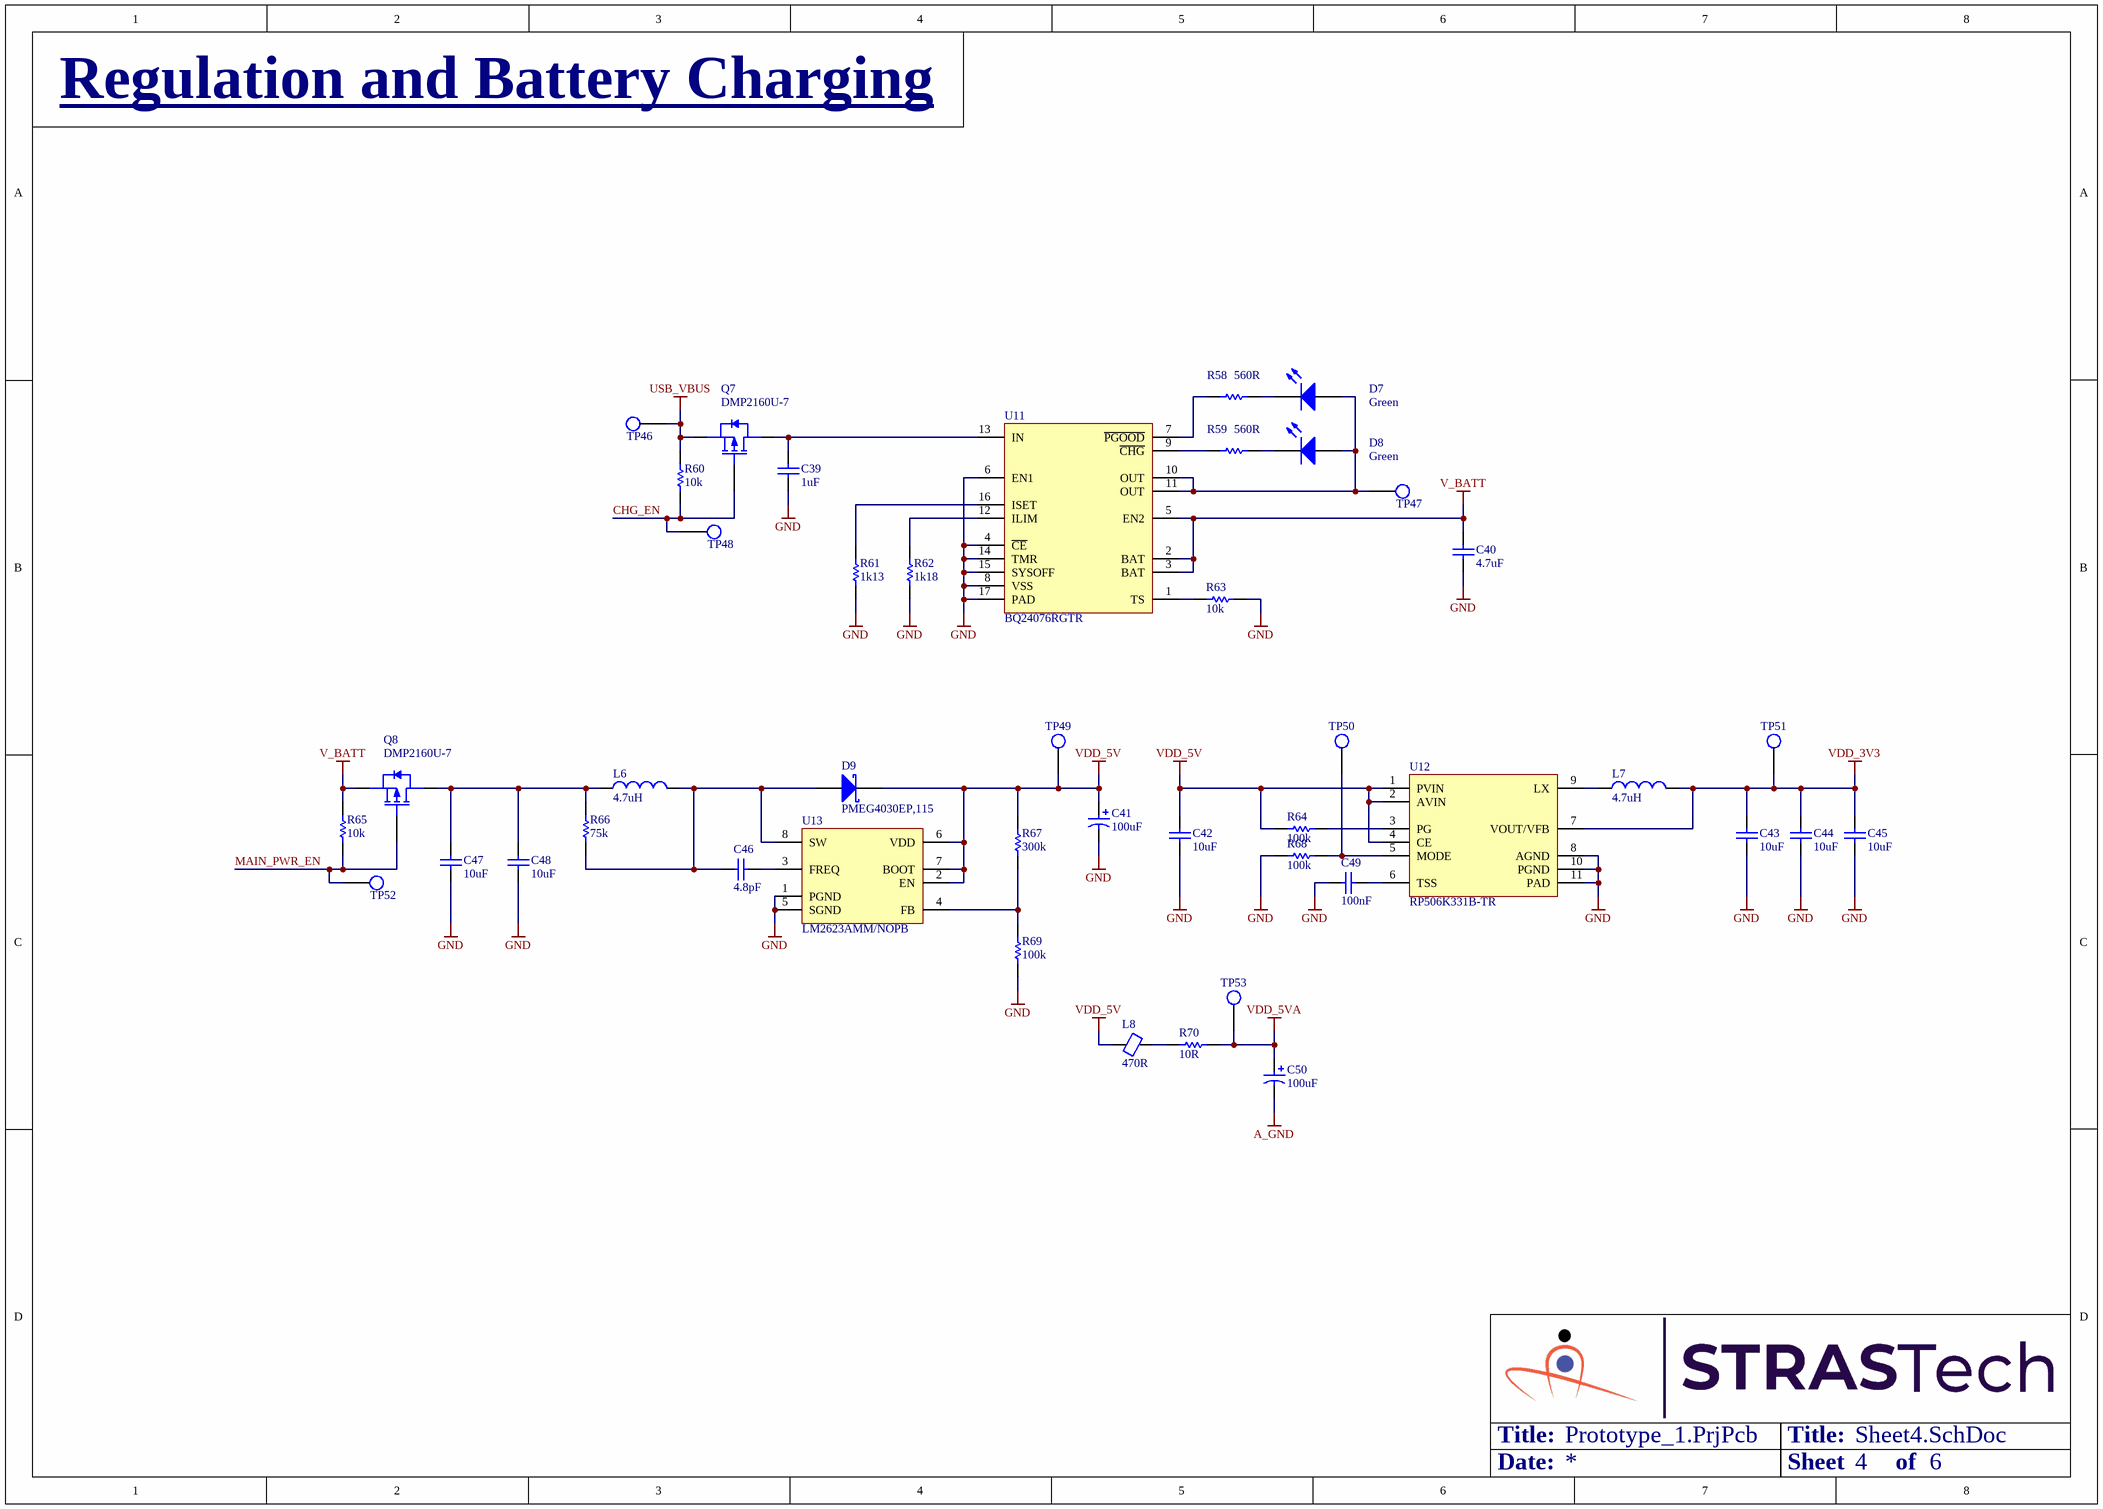
[diagram p3: Sheet4.SchDoc]

### Parts
C39  1uF  [Cap,SMD,0402]
C40  4.7uF  [Cap,SMD,0402]
C41  100uF  [Cap,Alum,SMD,D5,H5.8]
C42  10uF  [Cap,SMD,0402]
C43  10uF  [Cap,SMD,0402]
C44  10uF  [Cap,SMD,0402]
C45  10uF  [Cap,SMD,0402]
C46  4.8pF  [Cap,SMD,0402]
C47  10uF  [Cap,SMD,0402]
C48  10uF  [Cap,SMD,0402]
C49  100nF  [Cap,SMD,0402]
C50  100uF  [Cap,Alum,SMD,D5,H5.8]
D7  Green  [LED,0603]
D8  Green  [LED,0603]
D9  PMEG4030EP,115  [SOD128]
L6  4.7uH  [IND,WIREWOUND,4.9x4.9,SMD]
L7  4.7uH  [IND,WIREWOUND,4.9x4.9,SMD]
L8  470R  [IND,0402]
Q7  DMP2160U-7  [SOT23-3]
Q8  DMP2160U-7  [SOT23-3]
R58  560R  [RES,0402]
R59  560R  [RES,0402]
R60  10k  [RES,0402]
R61  1k13  [RES,0402]
R62  1k18  [RES,0402]
R63  10k  [RES,0402]
R64  100k  [RES,0402]
R65  10k  [RES,0402]
R66  75k  [RES,0402]
R67  300k  [RES,0402]
R68  100k  [RES,0402]
R69  100k  [RES,0402]
R70  10R  [RES,0402]
TP46  TESTPOINT  [testpoint,smd,round,1mm]  (value not drawn)
TP47  TESTPOINT  [testpoint,smd,round,1mm]  (value not drawn)
TP48  TESTPOINT  [testpoint,smd,round,1mm]  (value not drawn)
TP49  TESTPOINT  [testpoint,smd,round,1mm]  (value not drawn)
TP50  TESTPOINT  [testpoint,smd,round,1mm]  (value not drawn)
TP51  TESTPOINT  [testpoint,smd,round,1mm]  (value not drawn)
TP52  TESTPOINT  [testpoint,smd,round,1mm]  (value not drawn)
TP53  TESTPOINT  [testpoint,smd,round,1mm]  (value not drawn)
U11  BQ24076RGTR  [IC,QFN-16,3x3]
U12  RP506K331B-TR  [IC,DFN-10_3x3,P0.5mm]
U13  LM2623AMM/NOPB  [IC,TSSOP-8,W3.0]

### Nets
A_GND: C50.2
GND: C39.1 C40.1 C41.2 C42.1 C43.1 C44.1 C45.1 C47.1 C48.1 C49.1 R61.1 R62.1 R63.1 R68.2 R69.1 U11.4(~{CE}) U11.6(EN1) U11.8(VSS) U11.14(TMR) U11.15(SYSOFF) U11.17(PAD) U12.8(AGND) U12.10(PGND) U12.11(PAD) U13.1(PGND) U13.5(SGND)
USB_VBUS: Q7.2(S) R60.2 TP46.1(TP)
V_BATT: C40.2 Q8.2(S) R65.2 U11.2(BAT) U11.3(BAT) U11.5(EN2)
VDD_3V3: C43.2 C44.2 C45.2 L7.2 TP51.1(TP) U12.7(VOUT/VFB)
VDD_5V: C41.1 C42.2 D9.1(K) L8.1 R64.2 R67.2 TP49.1(TP) U12.1(PVIN) U12.2(AVIN) U12.4(CE) U13.2(EN) U13.6(VDD) U13.7(BOOT)
VDD_5VA: C50.1 R70.2 TP53.1(TP)
CHG_EN: Q7.1(G) R60.1 TP48.1(TP)
MAIN_PWR_EN: Q8.1(G) R65.1 TP52.1(TP)
NetC39_2: C39.2 Q7.3(D) U11.13(IN)
NetC46_1: C46.1 D9.2(A) L6.2 R66.1 U13.8(SW)
NetC46_2: C46.2 U13.3(FREQ)
NetC47_2: C47.2 C48.2 L6.1 Q8.3(D) R66.2
NetC49_2: C49.2 U12.6(TSS)
NetD7_1: D7.1(A) D8.1(A) TP47.1(TP) U11.10(OUT) U11.11(OUT)
NetD7_2: D7.2(K) R58.2
NetD8_2: D8.2(K) R59.2
NetL7_1: L7.1 U12.9(LX)
NetL8_2: L8.2 R70.1
NetR58_1: R58.1 U11.7(~{PGOOD})
NetR59_1: R59.1 U11.9(~{CHG})
NetR61_2: R61.2 U11.16(ISET)
NetR62_2: R62.2 U11.12(ILIM)
NetR63_2: R63.2 U11.1(TS)
NetR64_1: R64.1 U12.3(PG)
NetR67_1: R67.1 R69.2 U13.4(FB)
NetR68_1: R68.1 TP50.1(TP) U12.5(MODE)

### Notes on the sheet
- Regulation and Battery Charging
- Title:
- Date:
- Sheet
- of
- Title
- Size:
- A3
- Revision:
- Design By:

### Library data of the parts
C39 = CAP,Cer,1uF,35VDC,X5R,0402: as C5 on sheet Sheet1; HelpURL: https://product.tdk.com/info/en/catalog/datasheets/mlcc_commercial_general_en.pdf?ref_disty=digikey; CreatedBy: Judd Foster
C40 = CAP,Cer,4.7uF,16VDC,X5R,0402: as C22 on sheet Sheet2; HelpURL: https://datasheets.avx.com/cx5r.pdf; CreatedBy: Judd Foster
C41 C50 = CAP,Alum,100uF,10VDC,SMD: CAP ALUM 100UF 20% 10V SMD; Vendor Part Number: PCE3867CT-ND; Manufacturer: Panasonic; Manufacturer Part Number: EEE-1AA101WR; Vendor: Digikey; HelpURL: https://media.digikey.com/pdf/Data%20Sheets/Panasonic%20Electronic%20Components/S_Series,Type_V_Rev2018.pdf; CreatedBy: Judd Foster
C42-C45 C47 C48 = CAP,Cer,10uF,10VDC,X5R,0402: as C8 on sheet Sheet1; HelpURL: https://media.digikey.com/pdf/Data%20Sheets/Samsung%20PDFs/CL05A106MP5NUNC_Spec.pdf; CreatedBy: Judd Foster
C46 = CAP,Cer,4.8pF,50VDC,C0G/NP0,0402: as C3 on sheet Sheet1; HelpURL: https://search.murata.co.jp/Ceramy/image/img/A01X/G101/ENG/GCQ1555C1H4R8CB01-01.pdf; CreatedBy: Judd Foster
C49 = CAP,Cer,100nF,25VDC,X7R,0402: as C1 on sheet Sheet1; HelpURL: https://search.murata.co.jp/Ceramy/image/img/A01X/G101/ENG/GRM155R71E104KE14-01.pdf; CreatedBy: Judd Foster
D7 D8 = LED,Green,SMD,0603: as D1 on sheet Sheet2; CreatedBy: Judd Foster; HelpURL: http://www.stanley-components.com/php/downloaddatafile.php?rp=0,THG1111C-0005_e.pdf
D9 = DIODE,Schottky,40V,3A,SMD: Diode Schottky 40V 3A Surface Mount CFP5; Manufacturer: Nexperia USA Inc.; Vendor Part Number: 1727-5841-1-ND; Vendor: Digikey; CreatedBy: Judd Foster; HelpURL: https://assets.nexperia.com/documents/data-sheet/PMEG4030EP.pdf; Manufacturer Part Number: PMEG4030EP,115
L6 L7 = IND,4.7uH,2.6A,Wirewound,SMD: 4.7µH Shielded Wirewound Inductor 2.6A 45.5mOhm Max Nonstandard; Vendor Part Number: 587-3605-1-ND; Manufacturer: Taiyo Yuden; Manufacturer Part Number: NRS5030T4R7MMGJV; Vendor: Digikey; HelpURL: https://ds.yuden.co.jp/TYCOMPAS/ut/detail?pn=NRS5030T4R7MMGJV%20%20&u=M; CreatedBy: Judd Foster
L8 = Ferrite,470R@100MHz,0402: as L3 on sheet Sheet2; HelpURL: https://www.murata.com/en-us/products/productdata/8796740059166/ENFA0018.pdf; CreatedBy: Judd Foster
Q7 Q8 = MOSFET,P Ch,20V,3.2A: as Q1 on sheet Sheet2; CreatedBy: Judd Foster; HelpURL: https://media.digikey.com/pdf/Data%20Sheets/Diodes%20PDFs/DMP2160U.pdf; Manufacturer Part Number: DMP2160U-7
R58 R59 = RES,560R,1%,0.063W,0402: as R41 on sheet Sheet3; CreatedBy: Judd Foster; HelpURL: https://www.te.com/commerce/DocumentDelivery/DDEController?Action=srchrtrv&DocNm=1773204-3&DocType=DS&DocLang=English
R60 R63 R65 = RES,10k,5%,0.063W,0402: as R1 on sheet Sheet1; HelpURL: https://www.seielect.com/catalog/sei-rmcf_rmcp.pdf; CreatedBy: Judd Foster
R61 = RES,1k13,1%,0.063W,0402: 1.13 kOhms ±1% 0.063W, 1/16W Chip Resistor 0402 (1005 Metric) Automotive AEC-Q200 Thick Film; Manufacturer: Stackpole Electronics Inc; Manufacturer Part Number: RMCF0402FT1K13; Vendor Part Number: RMCF0402FT1K13CT-ND; Vendor: Digikey; CreatedBy: Judd Foster; HelpURL: https://www.seielect.com/catalog/sei-rmcf_rmcp.pdf
R62 = RES,1k18,1%,0.063W,0402: 1.18 kOhms ±1% 0.063W, 1/16W Chip Resistor 0402 (1005 Metric) Automotive AEC-Q200 Thick Film; Manufacturer: Stackpole Electronics Inc; Manufacturer Part Number: RMCF0402FT1K18; Vendor Part Number: RMCF0402FT1K18CT-ND; Vendor: Digikey; CreatedBy: Judd Foster; HelpURL: https://www.seielect.com/catalog/sei-rmcf_rmcp.pdf
R64 R68 R69 = RES,100k,5%,0.1W,0402: 100 kOhms ±5% 0.1W, 1/10W Chip Resistor 0402 (1005 Metric) Automotive AEC-Q200 Thick Film; Manufacturer: Panasonic Electronic Components; Manufacturer Part Number: ERJ-2GEJ104X; Vendor Part Number: P100KJCT-ND; Vendor: Digikey; CreatedBy: Judd Foster; HelpURL: https://b2b-api.panasonic.eu/file_stream/pids/fileversion/1242
R66 = RES,75k,0.1%,0.063W,0402: 75 kOhms ±0.1% 0.063W, 1/16W Chip Resistor 0402 (1005 Metric) - Thin Film; Vendor Part Number: YAG4414CT-ND; Manufacturer: YAGEO; Manufacturer Part Number: RT0402BRE0775KL; Vendor: DIgikey; HelpURL: https://www.yageo.com/upload/media/product/productsearch/datasheet/rchip/PYu-RT_1-to-0.01_RoHS_L_12.pdf; CreatedBy: Judd Foster
R67 = RES,300k,1%,0.063W,0402: as R34 on sheet Sheet3; CreatedBy: Judd Foster; HelpURL: https://www.seielect.com/catalog/sei-rmcf_rmcp.pdf
R70 = RES,10R,1%,0.063W,0402: as R37 on sheet Sheet3; CreatedBy: Judd Foster; HelpURL: https://industrial.panasonic.com/cdbs/www-data/pdf/RDA0000/AOA0000C304.pdf
TP46-TP53 = TESTPOINT: PCB Testpoint; CreatedBy: Judd Foster; HelpURL: N/A; Manufacturer: N/A; Manufacturer Part Number: N/A; Vendor: N/A; Vendor Part Number: N/A
U11 = BQ24076RGTR: Charger IC Lithium Ion 16-VQFN (3x3); Vendor Part Number: 296-52627-1-ND; Manufacturer: Texas Instruments; Vendor: Digikey; HelpURL: https://www.ti.com/general/docs/suppproductinfo.tsp?distId=10&gotoUrl=https%3A%2F%2Fwww.ti.com%2Flit%2Fgpn%2Fbq24076; Manufacturer Part Number: BQ24076RGTR; CreatedBy: Judd Foster
U12 = RP506K331B-TR: Buck Switching Regulator IC Positive Fixed 3.3V 1 Output 2A 10-UFDFN Exposed Pad; Manufacturer: Nisshinbo Micro Devices Inc.; Vendor Part Number: 2129-RP506K331B-CT-ND; Vendor: Digikey; CreatedBy: Judd Foster; HelpURL: https://www.nisshinbo-microdevices.co.jp/en/pdf/datasheet/rp506-ea.pdf; Manufacturer Part Number: RP506K331B-TR
U13 = LM2623AMM/NOPB: Boost Switching Regulator IC Positive Adjustable 1.24V 1 Output 2.2A (Switch) 8-TSSOP, 8-MSOP (0.118", 3.00mm Width); Vendor Part Number: LM2623AMM/NOPBCT-ND; Manufacturer: Texas Instruments; Vendor: Digikey; Manufacturer Part Number: LM2623AMM/NOPB; HelpURL: https://www.ti.com/general/docs/suppproductinfo.tsp?distId=10&gotoUrl=https%3A%2F%2Fwww.ti.com%2Flit%2Fgpn%2Flm2623; CreatedBy: Judd Foster

## Sheet Sheet5.SchDoc
size A3; Organization: Altium Limited; Address1: L3, 12a Rodborough Rd; Address2: Frenchs Forest; Address3: NSW; Address4: Australia 2086; SheetNumber: 5; SheetTotal: 6
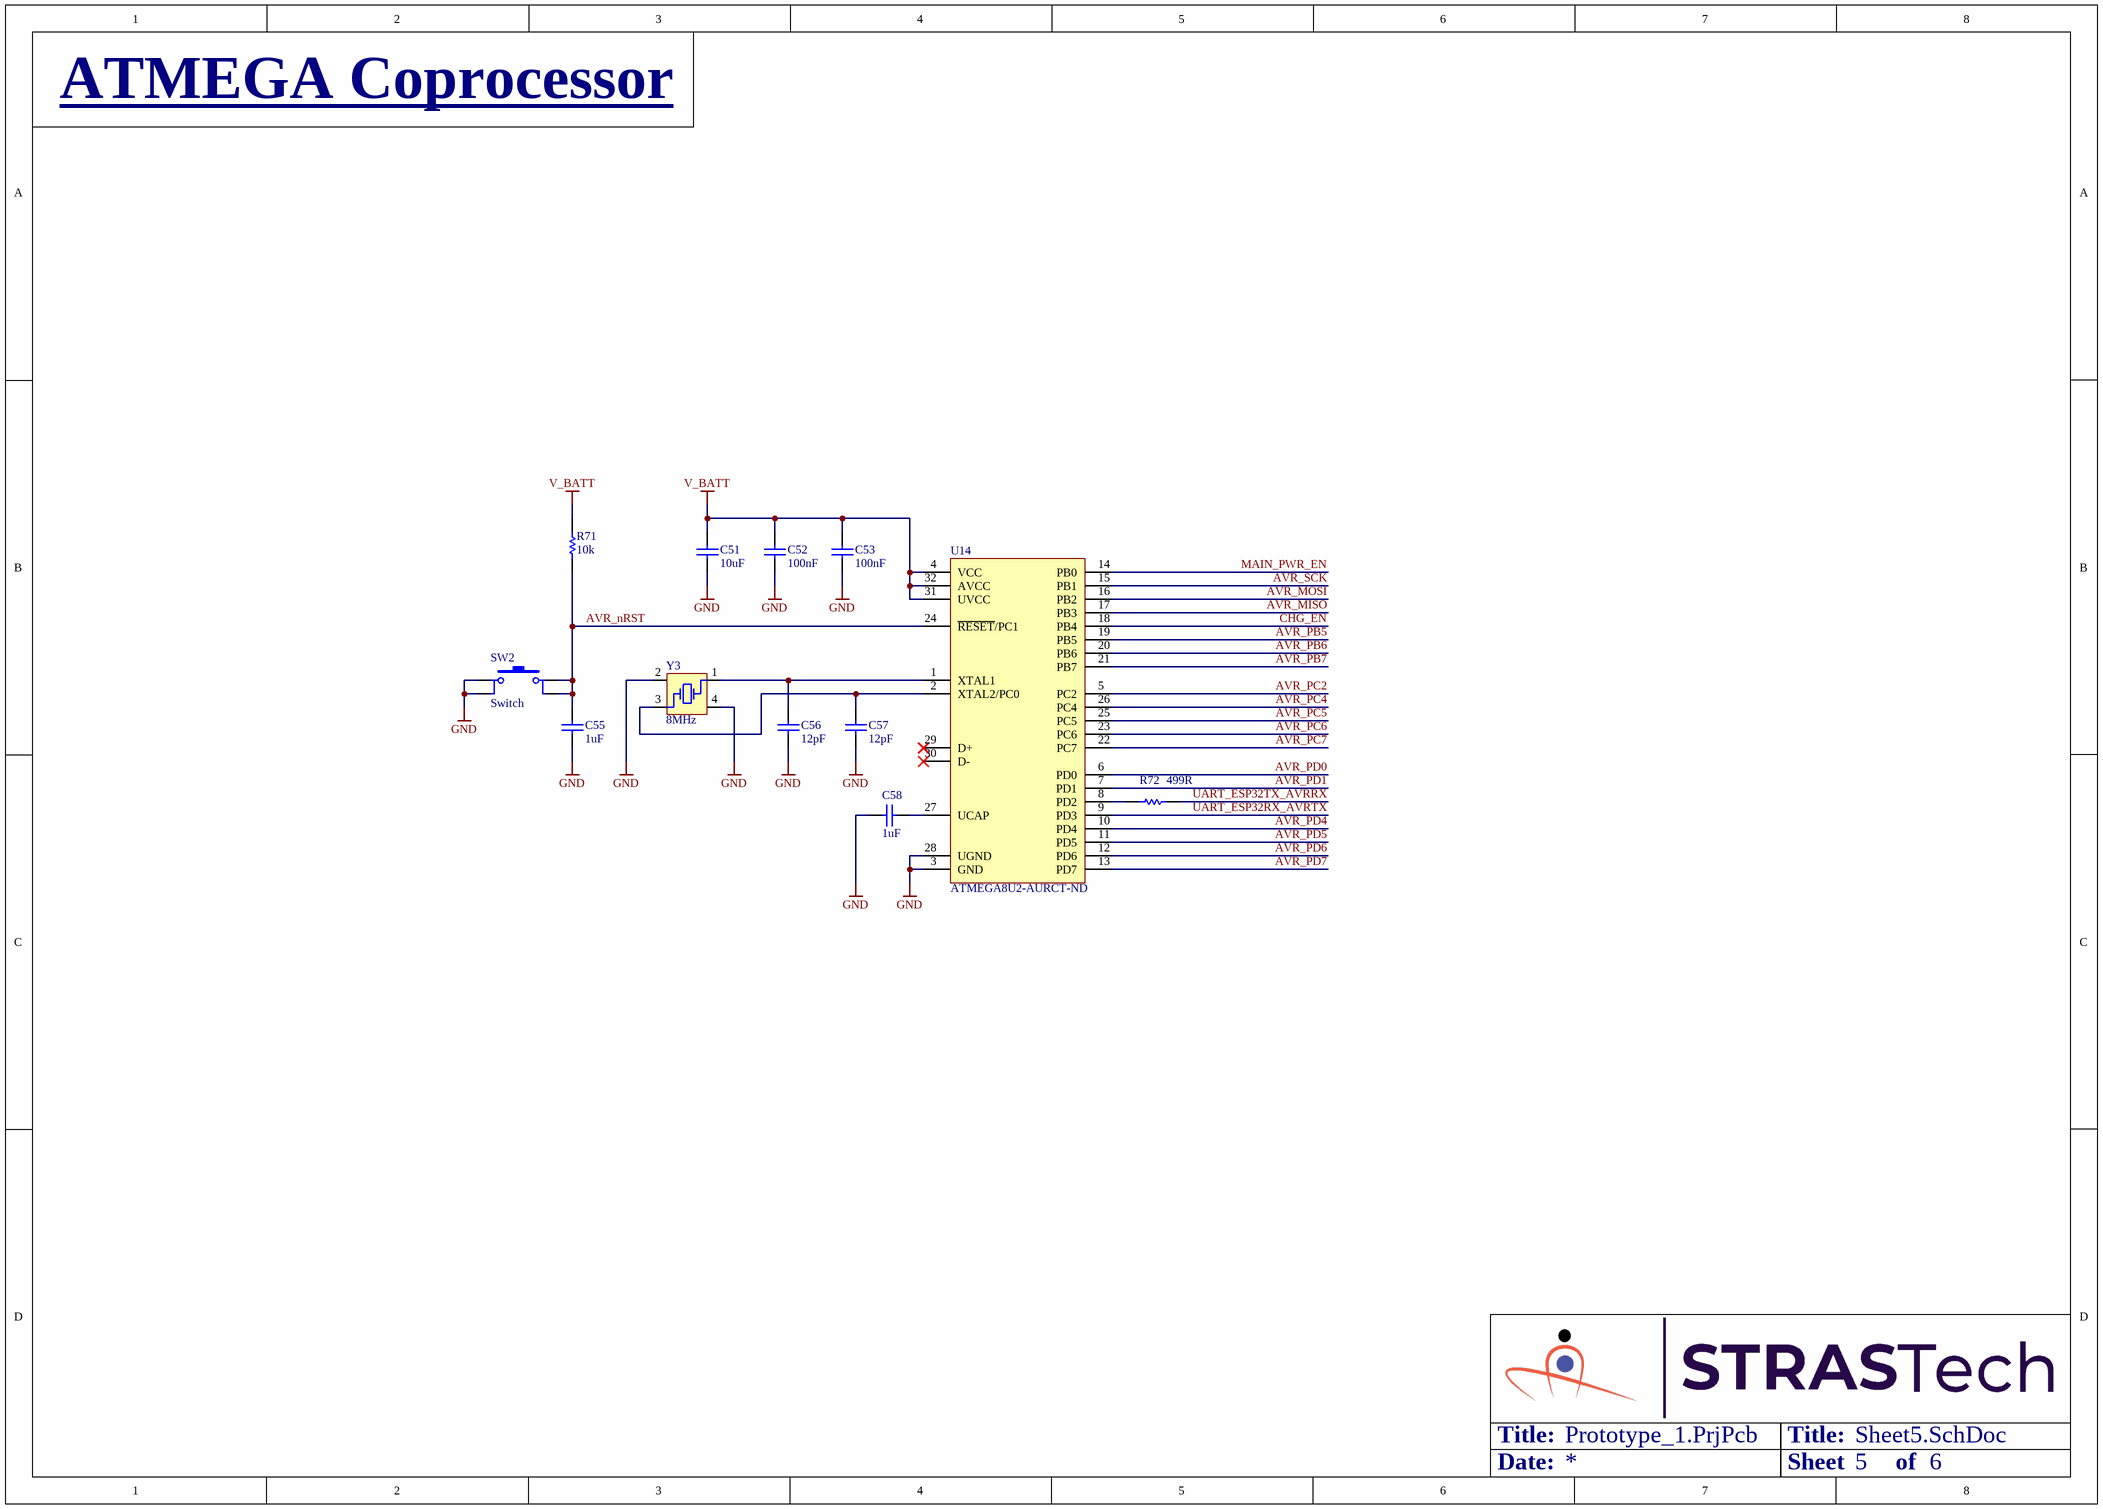
[diagram p4: Sheet5.SchDoc]

### Parts
C51  10uF  [Cap,SMD,0402]
C52  100nF  [Cap,SMD,0402]
C53  100nF  [Cap,SMD,0402]
C55  1uF  [Cap,SMD,0402]
C56  12pF  [Cap,SMD,0402]
C57  12pF  [Cap,SMD,0402]
C58  1uF  [Cap,SMD,0402]
R71  10k  [RES,0402]
R72  499R  [RES,0402]
SW2  Switch  [Switch,Tactile,Micro,SPST-NO,SMD]
U14  ATMEGA8U2-AURCT-ND  [IC,TQFP-32,7x7,P0.8MM]
Y3  8MHz  [XTAL,SMD,4 Pin]

### Nets
GND: C51.1 C52.1 C53.1 C55.2 C56.2 C57.2 C58.1 SW2.1 SW2.2 U14.3(GND) U14.28(UGND) Y3.2(GND) Y3.4(GND)
V_BATT: C51.2 C52.2 C53.2 R71.1 U14.4(VCC) U14.31(UVCC) U14.32(AVCC)
AVR_MISO: U14.17(PB3)
AVR_MOSI: U14.16(PB2)
AVR_nRST: C55.1 R71.2 SW2.3 SW2.4 U14.24(~{RESET}/PC1)
AVR_PB5: U14.19(PB5)
AVR_PB6: U14.20(PB6)
AVR_PB7: U14.21(PB7)
AVR_PC2: U14.5(PC2)
AVR_PC4: U14.26(PC4)
AVR_PC5: U14.25(PC5)
AVR_PC6: U14.23(PC6)
AVR_PC7: U14.22(PC7)
AVR_PD0: U14.6(PD0)
AVR_PD1: U14.7(PD1)
AVR_PD4: U14.10(PD4)
AVR_PD5: U14.11(PD5)
AVR_PD6: U14.12(PD6)
AVR_PD7: U14.13(PD7)
AVR_SCK: U14.15(PB1)
CHG_EN: U14.18(PB4)
MAIN_PWR_EN: U14.14(PB0)
UART_ESP32RX_AVRTX: U14.9(PD3)
UART_ESP32TX_AVRRX: R72.2
NetC56_1: C56.1 U14.1(XTAL1) Y3.1(OSC1)
NetC57_1: C57.1 U14.2(XTAL2/PC0) Y3.3(OSC2)
NetC58_2: C58.2 U14.27(UCAP)
NetR72_1: R72.1 U14.8(PD2)

Not connected (* = marked no-connect by the designer): U14 29(D+)* 30(D-)*

### Notes on the sheet
- ATMEGA Coprocessor
- Title:
- Date:
- Sheet
- of
- Title
- Size:
- A3
- Revision:
- Design By:

### Library data of the parts
C51 = CAP,Cer,10uF,10VDC,X5R,0402: as C8 on sheet Sheet1; HelpURL: https://media.digikey.com/pdf/Data%20Sheets/Samsung%20PDFs/CL05A106MP5NUNC_Spec.pdf; CreatedBy: Judd Foster
C52 C53 = CAP,Cer,100nF,25VDC,X7R,0402: as C1 on sheet Sheet1; HelpURL: https://search.murata.co.jp/Ceramy/image/img/A01X/G101/ENG/GRM155R71E104KE14-01.pdf; CreatedBy: Judd Foster
C55 C58 = CAP,Cer,1uF,35VDC,X5R,0402: as C5 on sheet Sheet1; HelpURL: https://product.tdk.com/info/en/catalog/datasheets/mlcc_commercial_general_en.pdf?ref_disty=digikey; CreatedBy: Judd Foster
C56 C57 = CAP,Cer,12pF,50VDC,C0G/NP0,0402: as C17 on sheet Sheet1; HelpURL: https://www.yageo.com/upload/media/product/productsearch/datasheet/mlcc/UPY-GP_NP0_16V-to-50V_18.pdf; CreatedBy: Judd Foster
R71 = RES,10k,5%,0.063W,0402: as R1 on sheet Sheet1; HelpURL: https://www.seielect.com/catalog/sei-rmcf_rmcp.pdf; CreatedBy: Judd Foster
R72 = RES,499R,1%,0.063W,0402: as R2 on sheet Sheet1; CreatedBy: Judd Foster; HelpURL: https://www.seielect.com/catalog/sei-rmcf_rmcp.pdf
SW2 = Switch,Tactile,SPST-NO,SMD,H1.5: as SW1 on sheet Sheet1; CreatedBy: Judd Foster; HelpURL: https://www.ckswitches.com/media/1467/pts525.pdf
U14 = ATMEGA8U2-AURCT-ND: AVR series Microcontroller IC 8-Bit 16MHz 8KB (4K x 16) FLASH 32-TQFP (7x7); Manufacturer: Microchip Technology; Vendor: Digikey; Manufacturer Part Number: ATMEGA8U2-AUR; Vendor Part Number: ATMEGA8U2-AURCT-ND; CreatedBy: Judd Foster; HelpURL: https://ww1.microchip.com/downloads/en/DeviceDoc/7799S.pdf
Y3 = XTAL,8MHz,12pF,SMD: 8 MHz ±20ppm Crystal 12pF 400 Ohms 4-SMD, No Lead; Manufacturer: ECS Inc.; Manufacturer Part Number: ECS-80-12-33-JGN-TR; Vendor Part Number: 50-ECS-80-12-33-JGN-CT-ND; Vendor: Digikey; CreatedBy: Judd Foster; HelpURL: https://www.mouser.ca/datasheet/2/122/ecx_32-1100709.pdf

## Sheet Sheet6.SchDoc
size A3; Organization: Altium Limited; Address1: L3, 12a Rodborough Rd; Address2: Frenchs Forest; Address3: NSW; Address4: Australia 2086; SheetNumber: 6; SheetTotal: 6
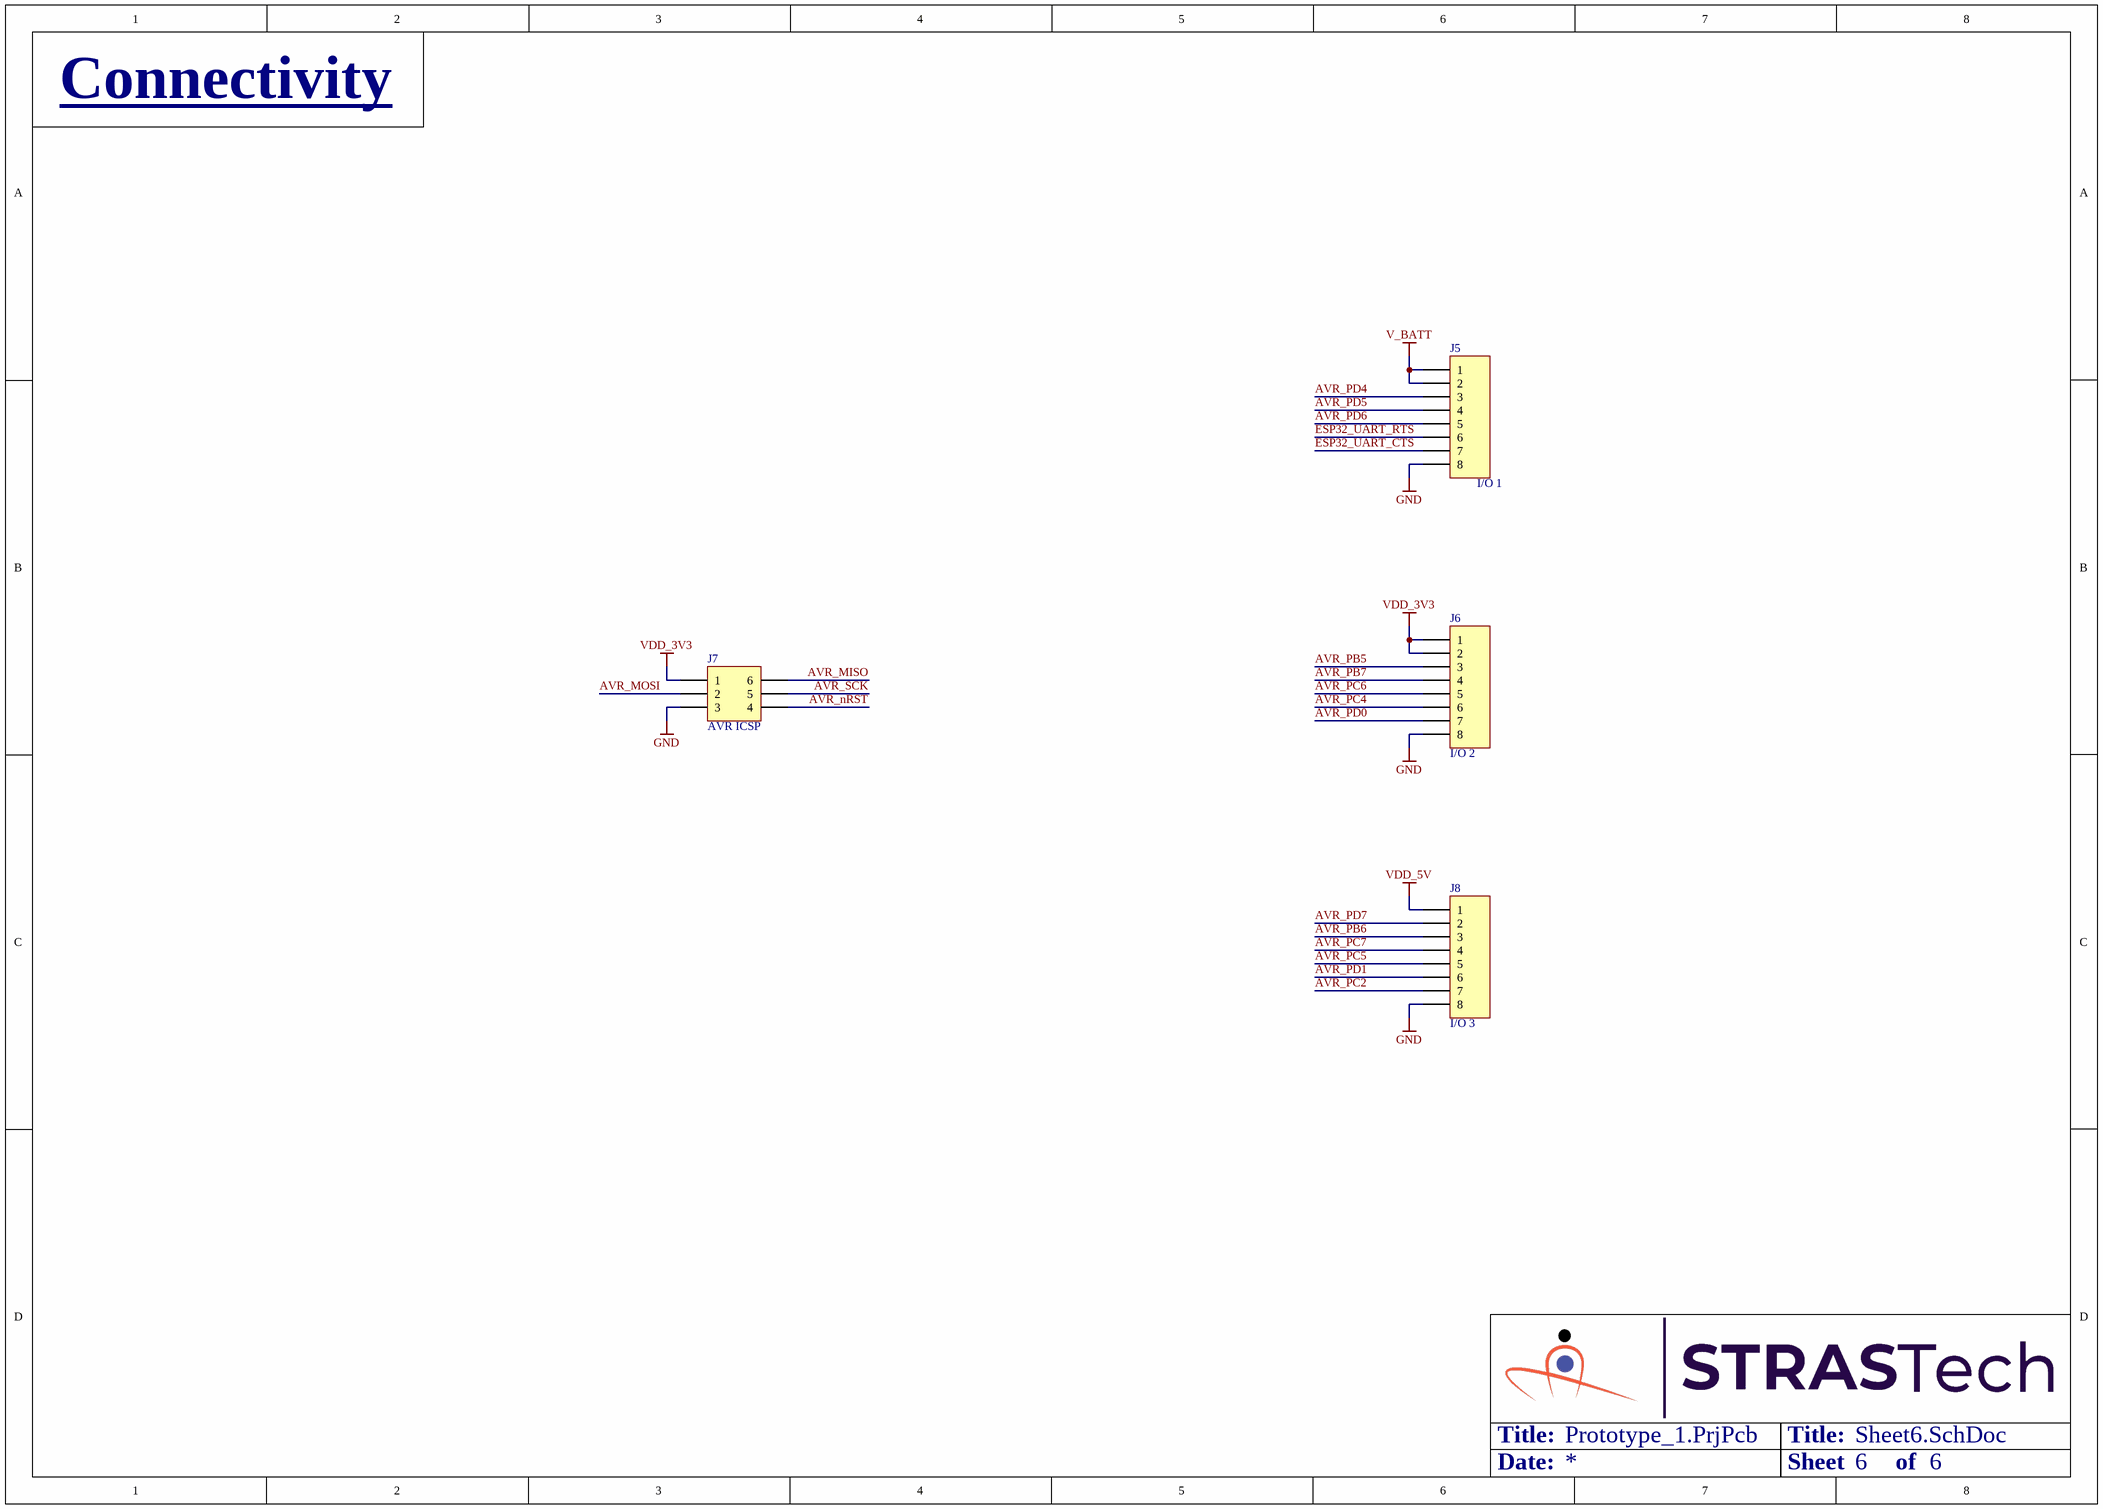
[diagram p5: Sheet6.SchDoc]

### Parts
J5  Term,Header,8 Pin,Top,2.54mm  [Term,Header,8Pin,2.54mm]  (value not drawn)
J6  Term,Header,8 Pin,Top,2.54mm  [Term,Header,8Pin,2.54mm]  (value not drawn)
J7  Term,Header,3x2 Pin,2.54mm,SMD  [TERM,HEADER,3X2PIN,P2.54,SMD]  (value not drawn)
J8  Term,Header,8 Pin,Top,2.54mm  [Term,Header,8Pin,2.54mm]  (value not drawn)

### Nets
GND: J5.8 J6.8 J7.3 J8.8
V_BATT: J5.1 J5.2
VDD_3V3: J6.1 J6.2 J7.1
VDD_5V: J8.1
AVR_MISO: J7.6
AVR_MOSI: J7.2
AVR_nRST: J7.4
AVR_PB5: J6.3
AVR_PB6: J8.3
AVR_PB7: J6.4
AVR_PC2: J8.7
AVR_PC4: J6.6
AVR_PC5: J8.5
AVR_PC6: J6.5
AVR_PC7: J8.4
AVR_PD0: J6.7
AVR_PD1: J8.6
AVR_PD4: J5.3
AVR_PD5: J5.4
AVR_PD6: J5.5
AVR_PD7: J8.2
AVR_SCK: J7.5
ESP32_UART_CTS: J5.7
ESP32_UART_RTS: J5.6

### Notes on the sheet
- Connectivity
- (near J5) I/O 1
- (near J7) AVR ICSP
- (near J6) I/O 2
- (near J8) I/O 3
- Title:
- Date:
- Sheet
- of
- Title
- Size:
- A3
- Revision:
- Design By:

### Library data of the parts
J5 J6 J8 = Term,Header,8 Pin,Top,2.54mm: CONN HEADER VERT 8POS 2.54MM; Vendor Part Number: 732-5321-ND; Manufacturer: Würth Elektronik; Manufacturer Part Number: 61300811121; Vendor: Digikey; HelpURL: https://katalog.we-online.de/em/datasheet/6130xx11121.pdf; Created By: Judd Foster
J7 = Term,Header,3x2 Pin,2.54mm,SMD: Connector Header Surface Mount 6 position 0.100" (2.54mm); Vendor Part Number: 609-10129383-906002ALFCT-ND; Manufacturer: Amphenol ICC (FCI); Manufacturer Part Number: 10129383-906002ALF; Vendor: Digikey; HelpURL: https://cdn.amphenol-icc.com/media/wysiwyg/files/drawing/10129383.pdf; CreatedBy: Judd Foster